# Altium project MACHXO3_STARTER KIT_22SEP14.PrjPcb
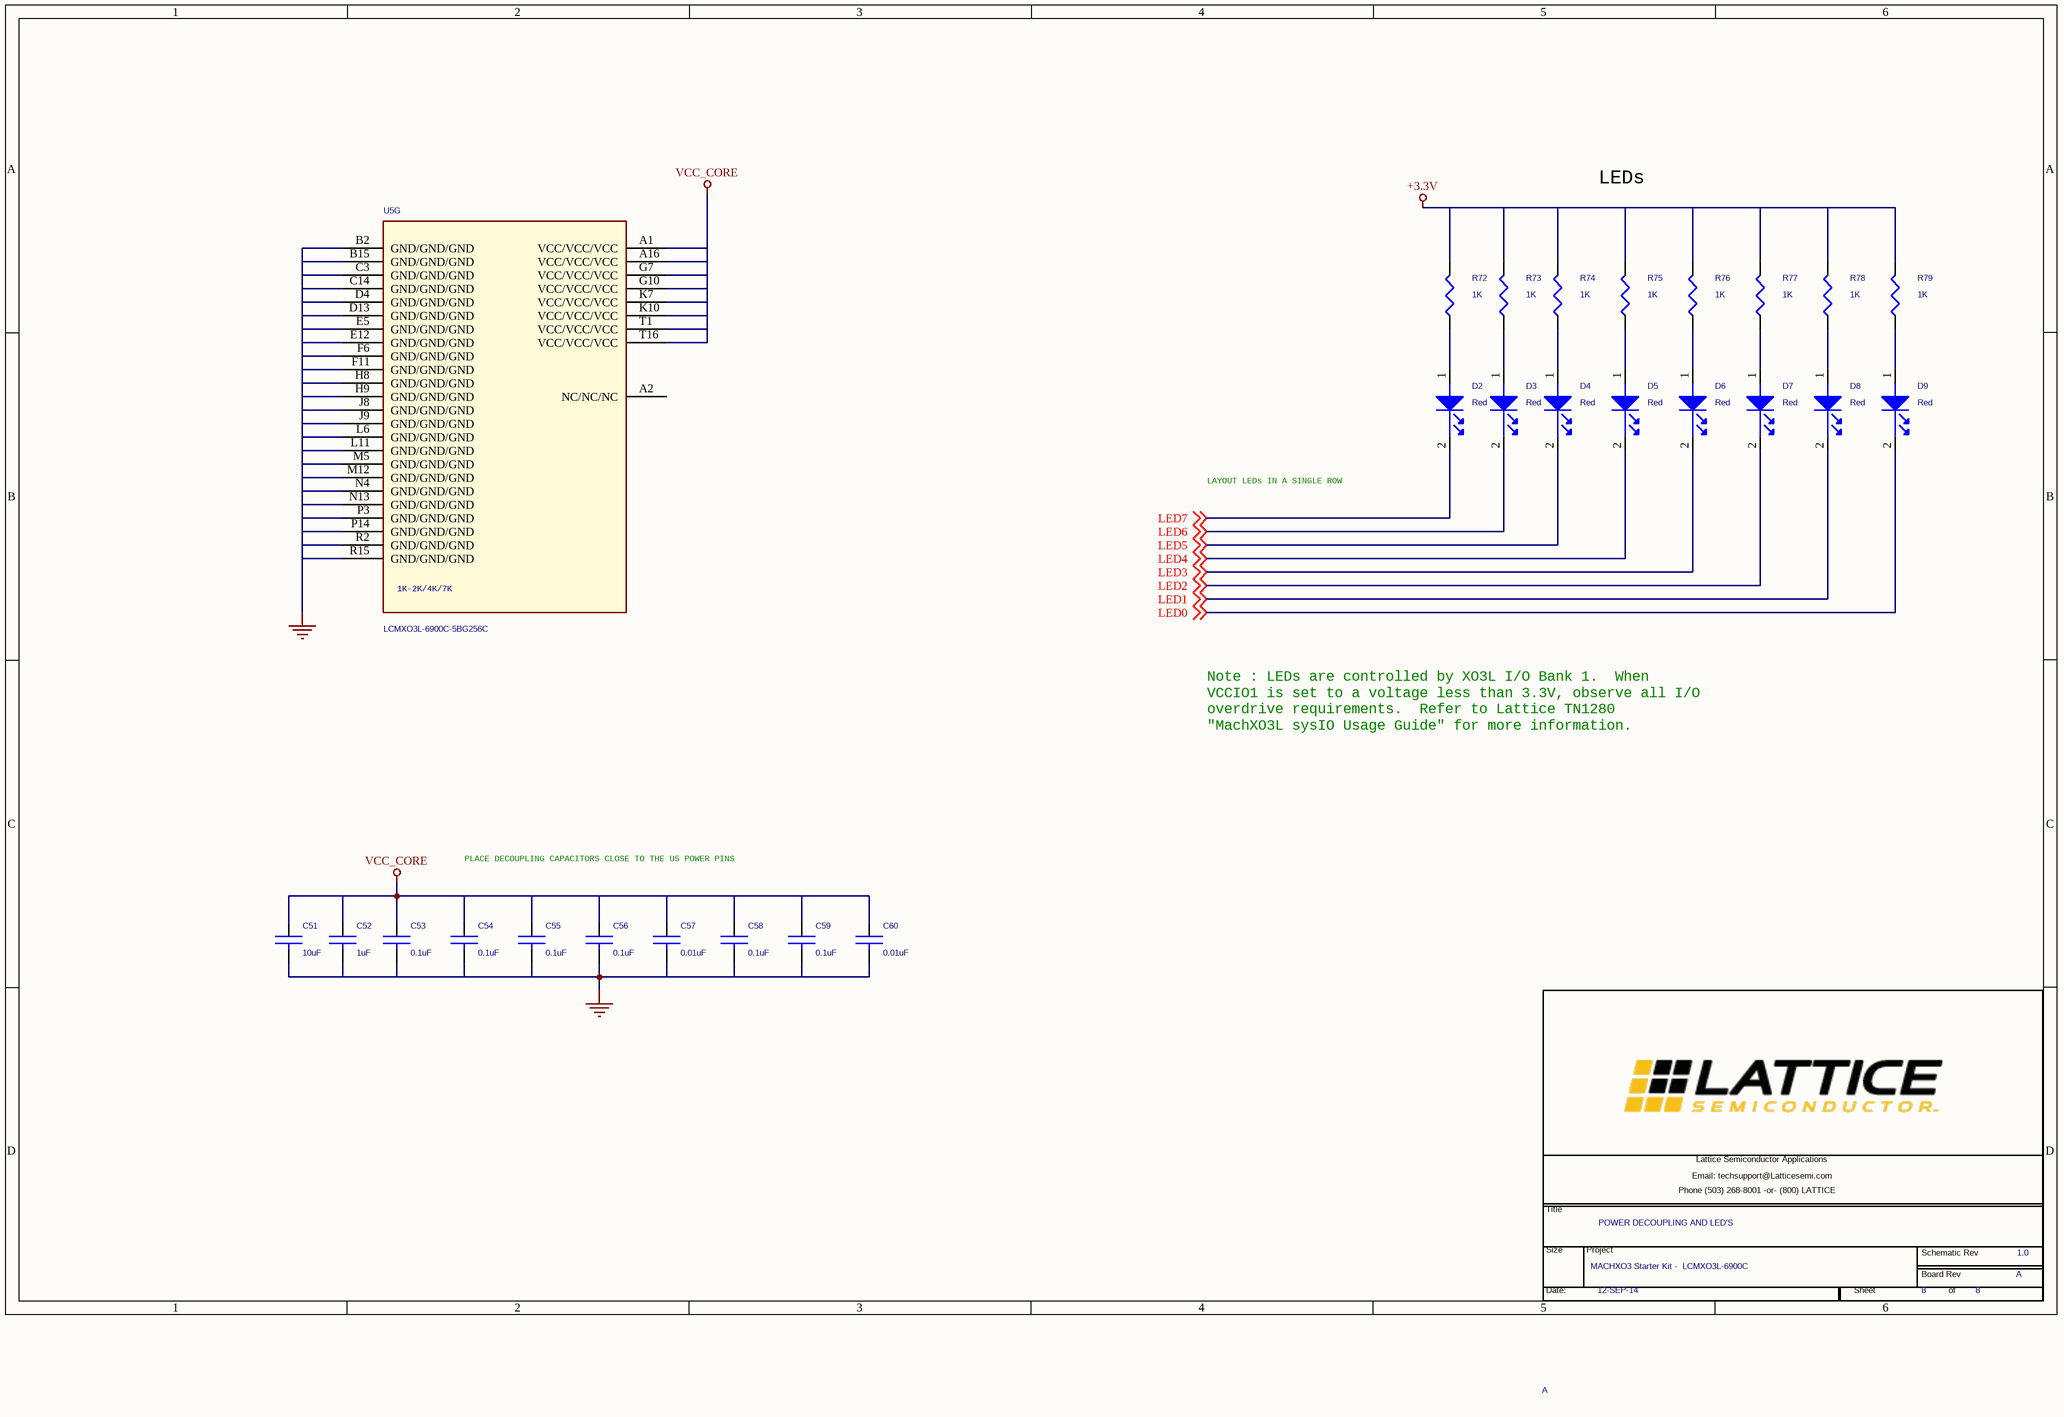
[diagram p0: PAGE8 - POWER DECAP AND.SchDoc]
8 sheets, 212 parts. Net scope: global (net labels, ports and power ports of the same name join across sheets).
Sheets:
  PAGE8 - POWER DECAP AND.SchDoc
  PAGE7 - BANK3,4,5 I_0.SchDoc
  PAGE6 - BANK2 I_0.SchDoc
  PAGE5 - BANK1 I_O.SchDoc
  PAGE4 - BANK0 I_O.SchDoc
  PAGE3 - POWER REGULATOR.SchDoc
  PAGE2 - USB to JTAG I_F.SchDoc
  PAGE1 -  Schematic cove.SchDoc

## Sheet PAGE8 - POWER DECAP AND.SchDoc
size 386 x 246 mm

### Parts
(Parts that share a designator on the sheet are numbered #1, #2 ... from top to bottom, then left to right.)
*#1  Project Name: MACHXO3 Starter Kit -  LCMXO3L-6900C  Title: POWER DECOUPLING AND LED'S  Page Number: 8  RevCode: 1.0  Page Size: A  Date:: 12-SEP-14  (hidden comment: Lattice Title Block New Brand)  (graphical)
C51  10uF  [cc0603]
C52  1uF  [cc0402]
C53  0.1uF  [cc0402]
C54  0.1uF  [cc0402]
C55  0.1uF  [cc0402]
C56  0.1uF  [cc0402]
C57  0.01uF  [cc0402]
C58  0.1uF  [cc0402]
C59  0.1uF  [cc0402]
C60  0.01uF  [cc0402]
D2  Red  [led_0603]
D3  Red  [led_0603]
D4  Red  [led_0603]
D5  Red  [led_0603]
D6  Red  [led_0603]
D7  Red  [led_0603]
D8  Red  [led_0603]
D9  Red  [led_0603]
R72  1K  [cr0402]
R73  1K  [cr0402]
R74  1K  [cr0402]
R75  1K  [cr0402]
R76  1K  [cr0402]
R77  1K  [cr0402]
R78  1K  [cr0402]
R79  1K  [cr0402]
U5  LCMXO3L-6900C-5BG256C  [bga256_0p8_14p0]  (part G of 7)

### Nets
+3.3V: R72.2 R73.2 R74.2 R75.2 R76.2 R77.2 R78.2 R79.2
GND: C51.2 C52.2 C53.2 C54.2 C55.2 C56.2 C57.2 C58.2 C59.2 C60.2 U5.B2(GND/GND/GND) U5.B15(GND/GND/GND) U5.C3(GND/GND/GND) U5.C14(GND/GND/GND) U5.D4(GND/GND/GND) U5.D13(GND/GND/GND) U5.E5(GND/GND/GND) U5.E12(GND/GND/GND) U5.F6(GND/GND/GND) U5.F11(GND/GND/GND) U5.H8(GND/GND/GND) U5.H9(GND/GND/GND) U5.J8(GND/GND/GND) U5.J9(GND/GND/GND) U5.L6(GND/GND/GND) U5.L11(GND/GND/GND) U5.M5(GND/GND/GND) U5.M12(GND/GND/GND) U5.N4(GND/GND/GND) U5.N13(GND/GND/GND) U5.P3(GND/GND/GND) U5.P14(GND/GND/GND) U5.R2(GND/GND/GND) U5.R15(GND/GND/GND)
VCC_CORE: C51.1 C52.1 C53.1 C54.1 C55.1 C56.1 C57.1 C58.1 C59.1 C60.1 U5.A1(VCC/VCC/VCC) U5.A16(VCC/VCC/VCC) U5.G7(VCC/VCC/VCC) U5.G10(VCC/VCC/VCC) U5.K7(VCC/VCC/VCC) U5.K10(VCC/VCC/VCC) U5.T1(VCC/VCC/VCC) U5.T16(VCC/VCC/VCC)
LED0: D9.2(CATHODE) ; off-sheet LED0
LED1: D8.2(CATHODE) ; off-sheet LED1
LED2: D7.2(CATHODE) ; off-sheet LED2
LED3: D6.2(CATHODE) ; off-sheet LED3
LED4: D5.2(CATHODE) ; off-sheet LED4
LED5: D4.2(CATHODE) ; off-sheet LED5
LED6: D3.2(CATHODE) ; off-sheet LED6
LED7: D2.2(CATHODE) ; off-sheet LED7
NetD2_1: D2.1(ANODE) R72.1
NetD3_1: D3.1(ANODE) R73.1
NetD4_1: D4.1(ANODE) R74.1
NetD5_1: D5.1(ANODE) R75.1
NetD6_1: D6.1(ANODE) R76.1
NetD7_1: D7.1(ANODE) R77.1
NetD8_1: D8.1(ANODE) R78.1
NetD9_1: D9.1(ANODE) R79.1

Not connected (* = marked no-connect by the designer): U5 A2(NC/NC/NC)

### Notes on the sheet
- LEDs
- LAYOUT LEDs IN A SINGLE ROW
- Note : LEDs are controlled by XO3L I/O Bank 1.  When
  VCCIO1 is set to a voltage less than 3.3V, observe all I/O
  overdrive requirements.  Refer to Lattice TN1280
  "MachXO3L sysIO Usage Guide" for more information.
- PLACE DECOUPLING CAPACITORS CLOSE TO THE U5 POWER PINS
- (in symbol Lattice Title Block New Brand) Lattice Semiconductor Applications; Email: techsupport@Latticesemi.com; Phone (503) 268-8001 -or- (800) LATTICE; Title; Size; Project; Schematic Rev; Board Rev; Date:; Sheet; of
- (in symbol LCMXO3L-1K/2K/4K/7K-BG256, part G) 1K-2K/4K/7K

### Library data of the parts
C51 = 10uF_0603: CAP CER 10UF 10V 20% X5R 0603; Manufacturer Part Number: LMK107BJ106MALTD; Manufacturer: Taiyo Yuden; Class: Discrete; Digikey P/N: 587-2562-1-ND
C52 = 1uF_0402: CAP CER 1UF 6.3V 10% X5R 0402; Manufacturer Part Number: C0402C105K9PACTU; Manufacturer: Kemet; Class: Discrete; Digikey P/N: 399-4873-1-ND
C53-C56 C58 C59 = 0u1_0402: CAP CER 0.1UF 16V 10% X7R 0402; Manufacturer Part Number: C0402C104K4RACTU; Manufacturer: Kemet; Class: Discrete; Digikey P/N: 399-3521-2-ND
C57 C60 = 0_01uF_0402: CAP CER 10000PF 16V 5% X7R 0402; Manufacturer Part Number: C0402C103J4RACTU; Manufacturer: Kemet; Class: Discrete; Digikey P/N: 399-1039-1-ND
D2-D9 = LED_0603_Red: LED SUPER RED CLEAR 0603 SMD; Manufacturer Part Number: LTST-C190KRKT; Manufacturer: LITE-On INC; Class: Discrete; Digikey P/N: 160-1436-2-ND
R72-R79 = 1k_0402: RES 1K OHM 1/10W 1% 0603 SMD; Manufacturer: Yageo; Manufacturer Part Number: RC0603FR-071KL; Class: Discrete; Digikey P/N: 311-1.00KHRCT-ND
U5 = LCMXO3L-1K/2K/4K/7K-BG256: IC FPGA 6864LUTS 256BGA; Manufacturer: Lattice semi; SPLIT_INST: TRUE; SWAP_INFO: (S1+S2+S3+S4+S5+S6+S7); Graphic: LCMXO3L-1K/2K/4K/7K-BG256A.Normal; Power Pins Visible: False; Source Library: D:\DESIGN_DOC\XO3\LATTICEORCADCAPTURESCHEMATICLIBRARYOLB\LATTICEORCADCAPTURESCHEMATICLIBRARYOLB\LATTICE_SYM\LATTICEPLDS.OLB; Location Y-Coordinate: 0; Implementation Type: <none>; Primitive: DEFAULT; Name: I16790692; Digikey P/N: 220-1886-ND; Manufacturer Part Number: LCMXO3L-6900C-5BG256C; Source Package: LCMXO3L-1K/2K/4K/7K-BG256; Source Part: LCMXO3L-1K/2K/4K/7K-BG256A.Normal; Color: Default; Location X-Coordinate: 0
*#1 = Lattice Title Block New Brand: Page Count: 8; Board Rev: A

## Sheet PAGE7 - BANK3,4,5 I_0.SchDoc
size 386 x 246 mm
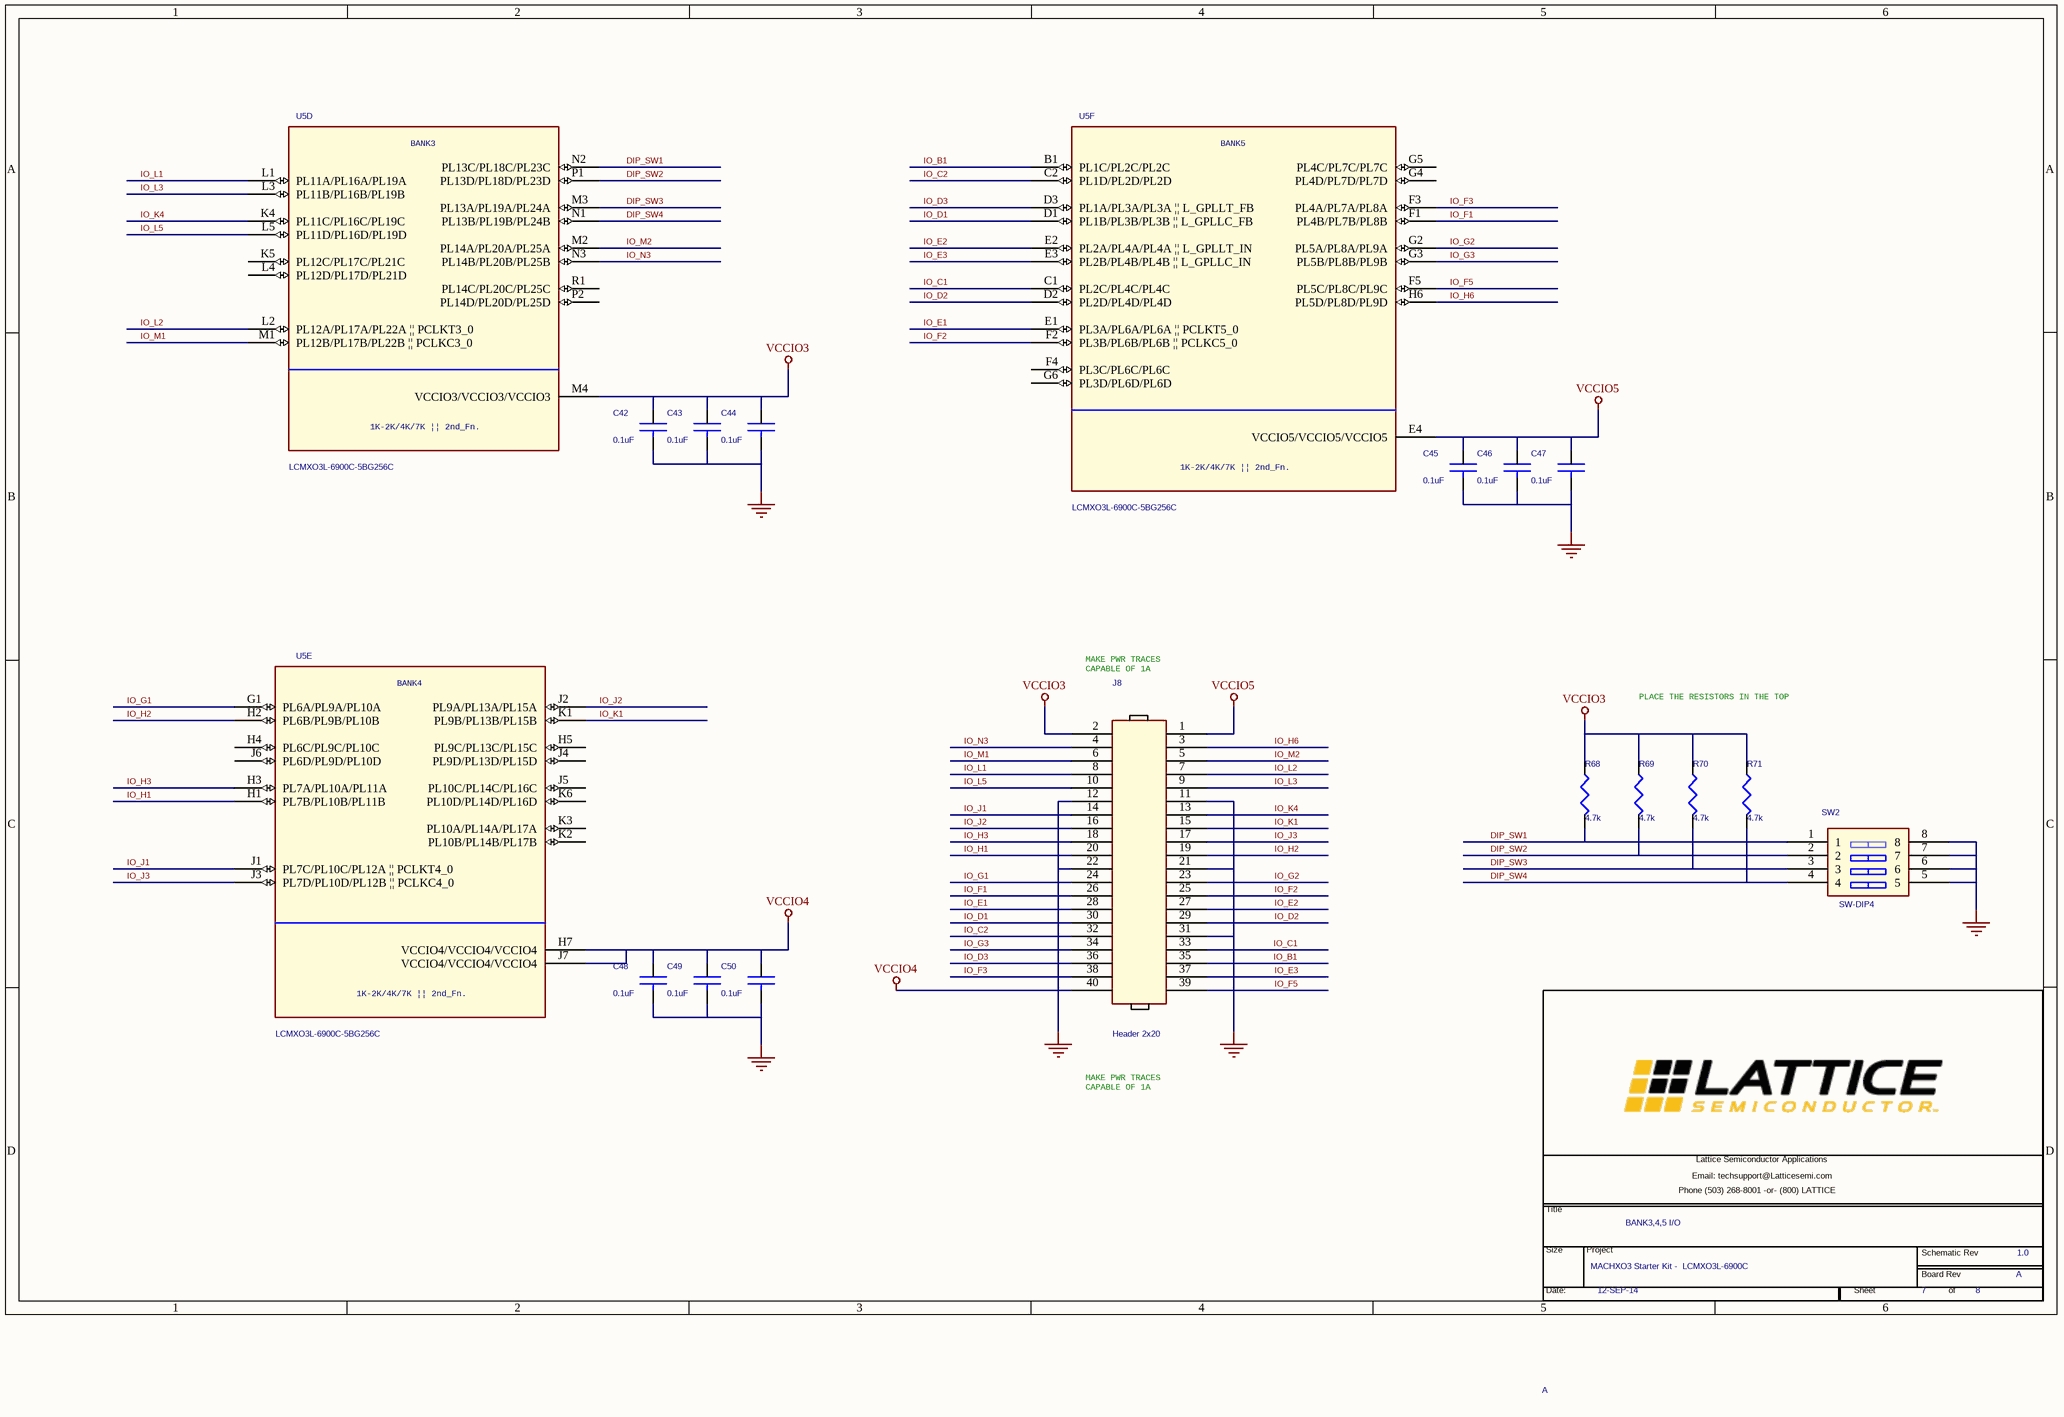
[diagram p1: PAGE7 - BANK3,4,5 I_0.SchDoc]

### Parts
(Parts that share a designator on the sheet are numbered #1, #2 ... from top to bottom, then left to right.)
*#2  Project Name: MACHXO3 Starter Kit -  LCMXO3L-6900C  Title: BANK3,4,5 I/O  Page Number: 7  Page Count: 8  RevCode: 1.0  Page Size: A  Date:: 12-SEP-14  (hidden comment: Lattice Title Block New Brand)  (graphical)
C42  0.1uF  [cc0402]
C43  0.1uF  [cc0402]
C44  0.1uF  [cc0402]
C45  0.1uF  [cc0402]
C46  0.1uF  [cc0402]
C47  0.1uF  [cc0402]
C48  0.1uF  [cc0402]
C49  0.1uF  [cc0402]
C50  0.1uF  [cc0402]
J8  Header 2x20  [hdr_samtec_mtsw_2x20_100]
R68  4.7k  [cr0402]
R69  4.7k  [cr0402]
R70  4.7k  [cr0402]
R71  4.7k  [cr0402]
SW2  SW-DIP4  [sw_sp_st_cts_195-4mst]
U5  LCMXO3L-6900C-5BG256C  [bga256_0p8_14p0]  (parts D,E,F of 7)

### Nets
GND: C42.2 C43.2 C44.2 C45.2 C46.2 C47.2 C48.2 C49.2 C50.2 J8.11 J8.12 J8.21 J8.22 J8.31 SW2.5 SW2.6 SW2.7 SW2.8
VCCIO3: C42.1 C43.1 C44.1 J8.2 R68.1 R69.1 R70.1 R71.1 U5.M4(VCCIO3/VCCIO3/VCCIO3)
VCCIO4: C48.1 C49.1 C50.1 J8.40 U5.H7(VCCIO4/VCCIO4/VCCIO4) U5.J7(VCCIO4/VCCIO4/VCCIO4)
VCCIO5: C45.1 C46.1 C47.1 J8.1 U5.E4(VCCIO5/VCCIO5/VCCIO5)
DIP_SW1: R68.2 SW2.1 U5.N2(PL13C/PL18C/PL23C)
DIP_SW2: R69.2 SW2.2 U5.P1(PL13D/PL18D/PL23D)
DIP_SW3: R70.2 SW2.3 U5.M3(PL13A/PL19A/PL24A)
DIP_SW4: R71.2 SW2.4 U5.N1(PL13B/PL19B/PL24B)
IO_B1: J8.35 U5.B1(PL1C/PL2C/PL2C)
IO_C1: J8.33 U5.C1(PL2C/PL4C/PL4C)
IO_C2: J8.32 U5.C2(PL1D/PL2D/PL2D)
IO_D1: J8.30 U5.D1(PL1B/PL3B/PL3B_||_L_GPLLC_FB)
IO_D2: J8.29 U5.D2(PL2D/PL4D/PL4D)
IO_D3: J8.36 U5.D3(PL1A/PL3A/PL3A_||_L_GPLLT_FB)
IO_E1: J8.28 U5.E1(PL3A/PL6A/PL6A_||_PCLKT5_0)
IO_E2: J8.27 U5.E2(PL2A/PL4A/PL4A_||_L_GPLLT_IN)
IO_E3: J8.37 U5.E3(PL2B/PL4B/PL4B_||_L_GPLLC_IN)
IO_F1: J8.26 U5.F1(PL4B/PL7B/PL8B)
IO_F2: J8.25 U5.F2(PL3B/PL6B/PL6B_||_PCLKC5_0)
IO_F3: J8.38 U5.F3(PL4A/PL7A/PL8A)
IO_F5: J8.39 U5.F5(PL5C/PL8C/PL9C)
IO_G1: J8.24 U5.G1(PL6A/PL9A/PL10A)
IO_G2: J8.23 U5.G2(PL5A/PL8A/PL9A)
IO_G3: J8.34 U5.G3(PL5B/PL8B/PL9B)
IO_H1: J8.20 U5.H1(PL7B/PL10B/PL11B)
IO_H2: J8.19 U5.H2(PL6B/PL9B/PL10B)
IO_H3: J8.18 U5.H3(PL7A/PL10A/PL11A)
IO_H6: J8.3 U5.H6(PL5D/PL8D/PL9D)
IO_J1: J8.14 U5.J1(PL7C/PL10C/PL12A_||_PCLKT4_0)
IO_J2: J8.16 U5.J2(PL9A/PL13A/PL15A)
IO_J3: J8.17 U5.J3(PL7D/PL10D/PL12B_||_PCLKC4_0)
IO_K1: J8.15 U5.K1(PL9B/PL13B/PL15B)
IO_K4: J8.13 U5.K4(PL11C/PL16C/PL19C)
IO_L1: J8.8 U5.L1(PL11A/PL16A/PL19A)
IO_L2: J8.7 U5.L2(PL12A/PL17A/PL22A_||_PCLKT3_0)
IO_L3: J8.9 U5.L3(PL11B/PL16B/PL19B)
IO_L5: J8.10 U5.L5(PL11D/PL16D/PL19D)
IO_M1: J8.6 U5.M1(PL12B/PL17B/PL22B_||_PCLKC3_0)
IO_M2: J8.5 U5.M2(PL14A/PL20A/PL25A)
IO_N3: J8.4 U5.N3(PL14B/PL20B/PL25B)

Not connected (* = marked no-connect by the designer): U5 F4(PL3C/PL6C/PL6C) G4(PL4D/PL7D/PL7D) G5(PL4C/PL7C/PL7C) G6(PL3D/PL6D/PL6D) H4(PL6C/PL9C/PL10C) H5(PL9C/PL13C/PL15C) J4(PL9D/PL13D/PL15D) J5(PL10C/PL14C/PL16C) J6(PL6D/PL9D/PL10D) K2(PL10B/PL14B/PL17B) K3(PL10A/PL14A/PL17A) K5(PL12C/PL17C/PL21C) K6(PL10D/PL14D/PL16D) L4(PL12D/PL17D/PL21D) P2(PL14D/PL20D/PL25D) R1(PL14C/PL20C/PL25C)

### Notes on the sheet
- MAKE PWR TRACES
  CAPABLE OF 1A
- PLACE THE RESISTORS IN THE TOP
- (in symbol Lattice Title Block New Brand) Lattice Semiconductor Applications; Email: techsupport@Latticesemi.com; Phone (503) 268-8001 -or- (800) LATTICE; Title; Size; Project; Schematic Rev; Board Rev; Date:; Sheet; of
- (in symbol LCMXO3L-1K/2K/4K/7K-BG256, part D) BANK3; 1K-2K/4K/7K || 2nd_Fn.
- (in symbol LCMXO3L-1K/2K/4K/7K-BG256, part E) BANK4; 1K-2K/4K/7K || 2nd_Fn.
- (in symbol LCMXO3L-1K/2K/4K/7K-BG256, part F) BANK5; 1K-2K/4K/7K || 2nd_Fn.

### Library data of the parts
C42-C50 = 0u1_0402: as C53 on sheet PAGE8 - POWER DECAP AND; Digikey P/N: 399-3521-2-ND
J8 = HEADER 20X2: CONN HEADER 40POS .100" DL GOLD; Manufacturer: Samtec; Manufacturer Part Number: TSW-120-07-G-D; ASSY: DNI; Digikey P/N: SAM1028-20-ND
R68-R71 = 5k1_0402: RES 4.70K OHM 1/10W 1% 0603 SMD; Manufacturer: Vishay; Manufacturer Part Number: CRCW06034K70FKEA; Class: Discrete; Digikey P/N: 541-4.70KHTR-ND
SW2 = DIP-SW: SWITCH SIDE ACTUATED 4 SEC 50V; Manufacturer Part Number: 195-4MST; Manufacturer: CTS Electrocomponents; Digikey P/N: CT1954MST-ND
U5 = LCMXO3L-1K/2K/4K/7K-BG256: IC FPGA 6864LUTS 256BGA; Manufacturer: Lattice semi; Source Part: LCMXO3L-1K/2K/4K/7K-BG256A.Normal; SPLIT_INST: TRUE; SWAP_INFO: (S1+S2+S3+S4+S5+S6+S7); Name: I16790692; Primitive: DEFAULT; Implementation Type: <none>; Location X-Coordinate: 0; Source Library: D:\DESIGN_DOC\XO3\LATTICEORCADCAPTURESCHEMATICLIBRARYOLB\LATTICEORCADCAPTURESCHEMATICLIBRARYOLB\LATTICE_SYM\LATTICEPLDS.OLB; Power Pins Visible: False; Digikey P/N: 220-1886-ND; Location Y-Coordinate: 0; Color: Default; Source Package: LCMXO3L-1K/2K/4K/7K-BG256; Graphic: LCMXO3L-1K/2K/4K/7K-BG256A.Normal; Manufacturer Part Number: LCMXO3L-6900C-5BG256C
*#2 = Lattice Title Block New Brand: Board Rev: A

## Sheet PAGE6 - BANK2 I_0.SchDoc
size 386 x 246 mm
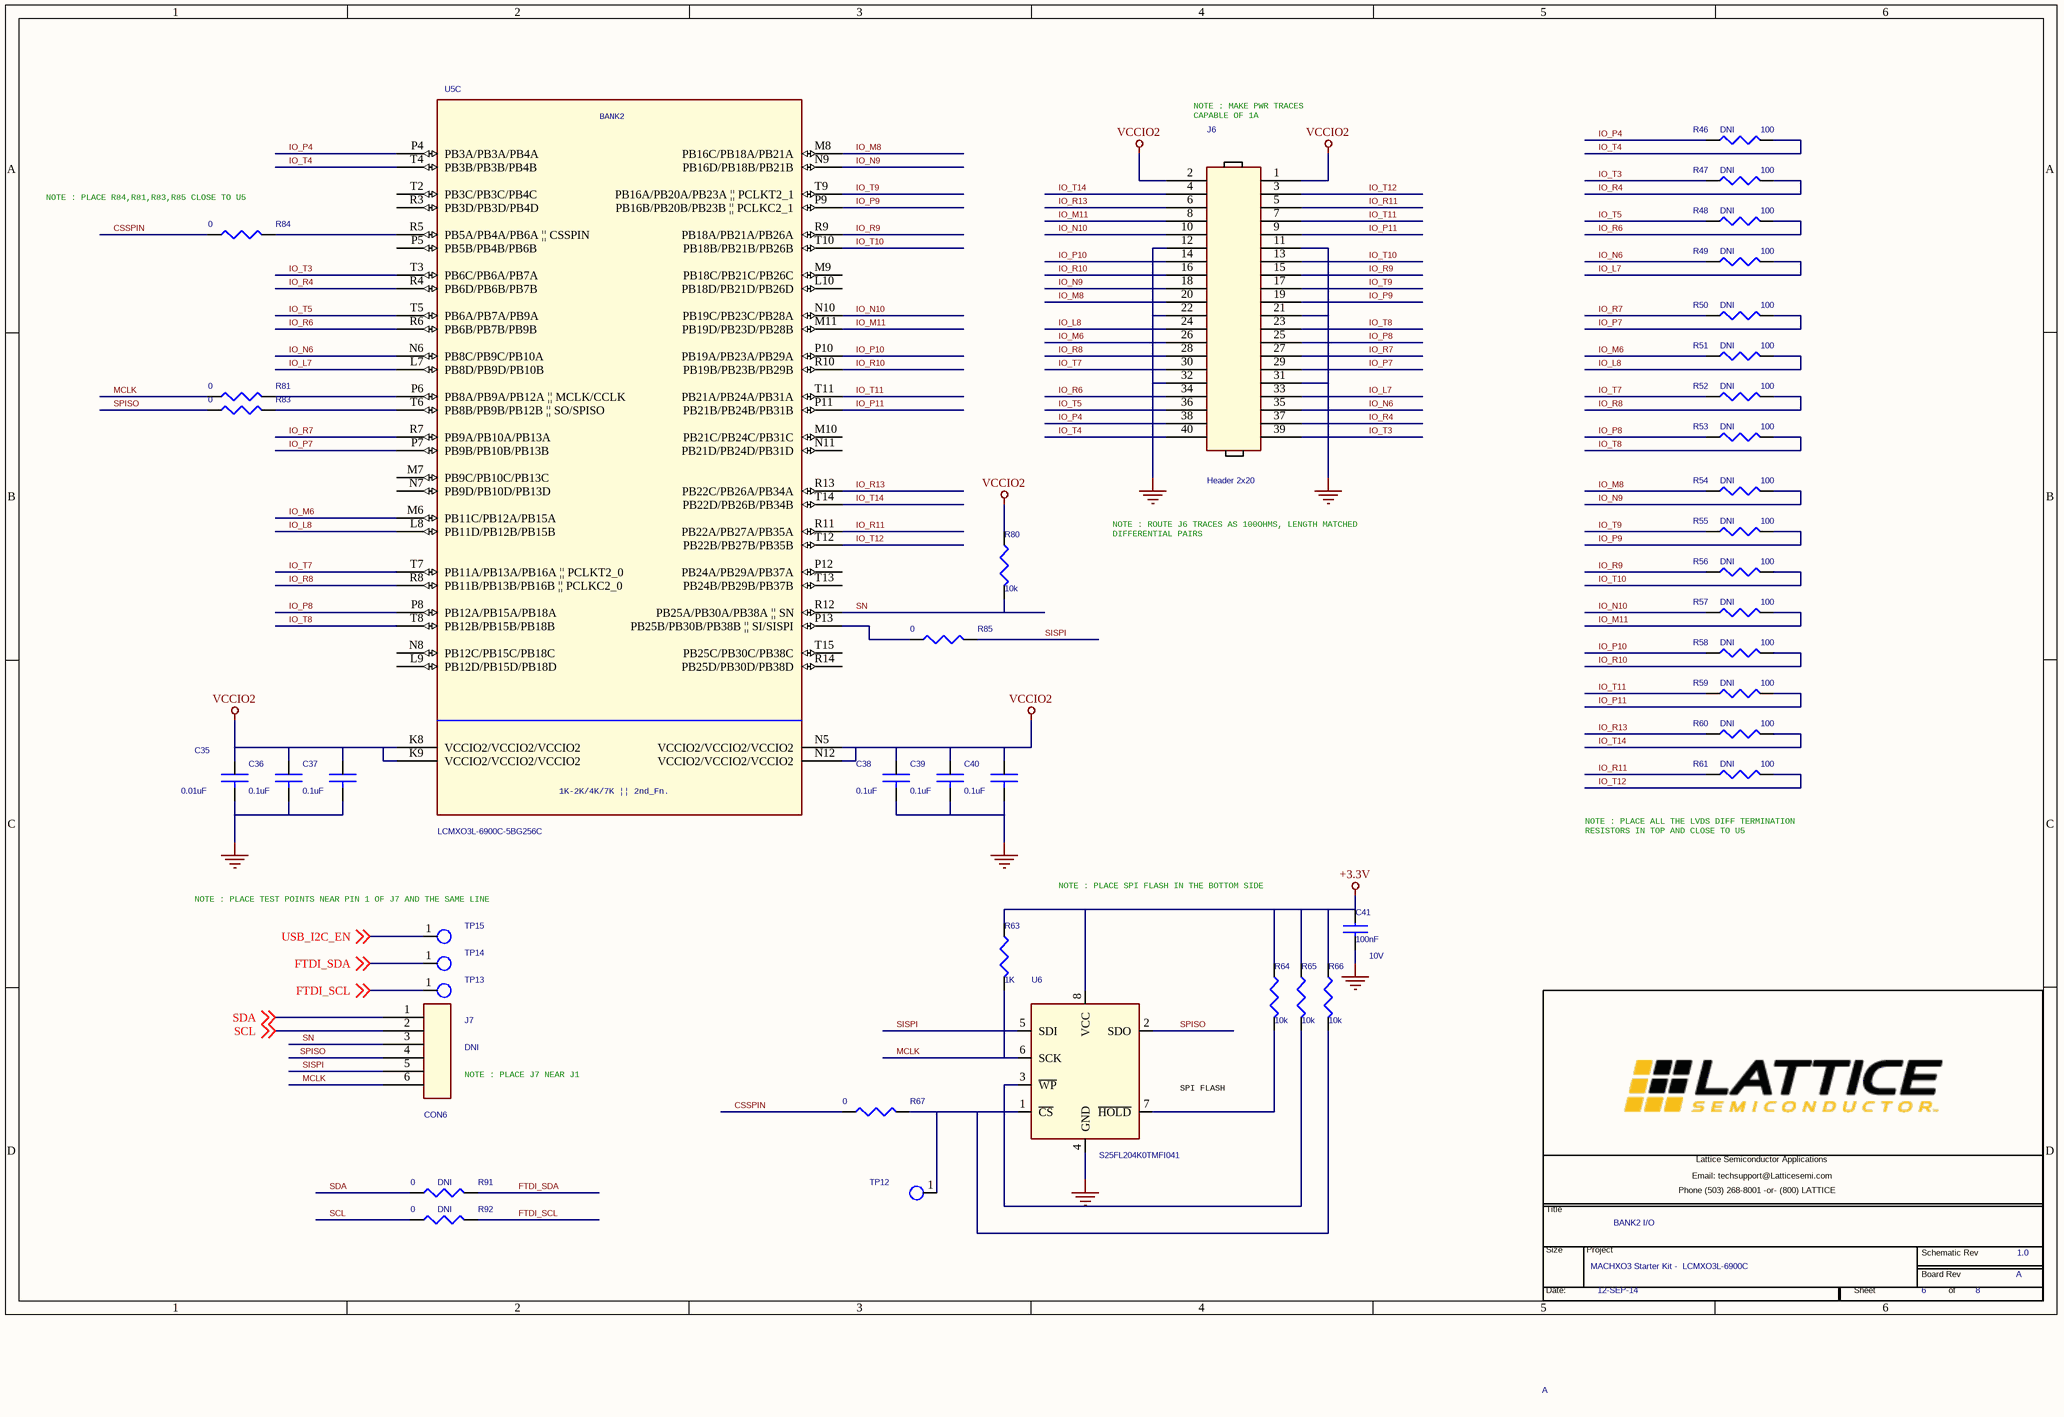
[diagram p2: PAGE6 - BANK2 I_0.SchDoc]

### Parts
(Parts that share a designator on the sheet are numbered #1, #2 ... from top to bottom, then left to right.)
*#3  Project Name: MACHXO3 Starter Kit -  LCMXO3L-6900C  Title: BANK2 I/O  Page Number: 6  Page Count: 8  RevCode: 1.0  Page Size: A  Date:: 12-SEP-14  (hidden comment: Lattice Title Block New Brand)  (graphical)
C35  0.01uF  [cc0402]
C36  0.1uF  [cc0402]
C37  0.1uF  [cc0402]
C38  0.1uF  [cc0402]
C39  0.1uF  [cc0402]
C40  0.1uF  [cc0402]
C41  100nF  Voltage: 10V  [C0402]
J6  Header 2x20  [hdr_samtec_mtsw_2x20_100]
J7  CON6  Assy: DNI  [hdr_samtec_tsw_1x6_100]
R46  100  Assy: DNI  [cr0603]
R47  100  Assy: DNI  [cr0603]
R48  100  Assy: DNI  [cr0603]
R49  100  Assy: DNI  [cr0603]
R50  100  Assy: DNI  [cr0603]
R51  100  Assy: DNI  [cr0603]
R52  100  Assy: DNI  [cr0603]
R53  100  Assy: DNI  [cr0603]
R54  100  Assy: DNI  [cr0603]
R55  100  Assy: DNI  [cr0603]
R56  100  Assy: DNI  [cr0603]
R57  100  Assy: DNI  [cr0603]
R58  100  Assy: DNI  [cr0603]
R59  100  Assy: DNI  [cr0603]
R60  100  Assy: DNI  [cr0603]
R61  100  Assy: DNI  [cr0603]
R63  1K  [R0402]
R64  10k  [R0402]
R65  10k  [R0402]
R66  10k  [R0402]
R67  0  [cr0603]
R80  10k  [R0402]
R81  0  [cr0603]
R83  0  [cr0603]
R84  0  [cr0603]
R85  0  [cr0603]
R91  0  Assy: DNI  [cr0603]
R92  0  Assy: DNI  [cr0603]
TP12  tp_s_40_63  [tp_s_40_63]  (value not drawn)
TP13  tp_s_40_63  [tp_s_40_63]  (value not drawn)
TP14  tp_s_40_63  [tp_s_40_63]  (value not drawn)
TP15  tp_s_40_63  [tp_s_40_63]  (value not drawn)
U5  LCMXO3L-6900C-5BG256C  [bga256_0p8_14p0]  (part C of 7)
U6  S25FL204K0TMFI041  [so8_50_244]

### Nets
+3.3V: C41.1 R63.1 R64.1 R65.1 R66.1 U6.8(VCC)
GND: C35.2 C36.2 C37.2 C38.2 C39.2 C40.2 C41.2 J6.11 J6.12 J6.21 J6.22 J6.31 J6.32 U6.4(GND)
VCCIO2: C35.1 C36.1 C37.1 C38.1 C39.1 C40.1 J6.1 J6.2 R80.1 U5.K8(VCCIO2/VCCIO2/VCCIO2) U5.K9(VCCIO2/VCCIO2/VCCIO2) U5.N5(VCCIO2/VCCIO2/VCCIO2) U5.N12(VCCIO2/VCCIO2/VCCIO2)
CSSPIN: R67.1 R84.1
FTDI_SCL: R92.2 TP13.1(TP) ; off-sheet FTDI_SCL
FTDI_SDA: R91.2 TP14.1(TP) ; off-sheet FTDI_SDA
IO_L7: J6.33 R49.2 U5.L7(PB8D/PB9D/PB10B)
IO_L8: J6.24 R51.2 U5.L8(PB11D/PB12B/PB15B)
IO_M6: J6.26 R51.1 U5.M6(PB11C/PB12A/PB15A)
IO_M8: J6.20 R54.1 U5.M8(PB16C/PB18A/PB21A)
IO_M11: J6.8 R57.2 U5.M11(PB19D/PB23D/PB28B)
IO_N6: J6.35 R49.1 U5.N6(PB8C/PB9C/PB10A)
IO_N9: J6.18 R54.2 U5.N9(PB16D/PB18B/PB21B)
IO_N10: J6.10 R57.1 U5.N10(PB19C/PB23C/PB28A)
IO_P4: J6.38 R46.1 U5.P4(PB3A/PB3A/PB4A)
IO_P7: J6.29 R50.2 U5.P7(PB9B/PB10B/PB13B)
IO_P8: J6.25 R53.1 U5.P8(PB12A/PB15A/PB18A)
IO_P9: J6.19 R55.2 U5.P9(PB16B/PB20B/PB23B_||_PCLKC2_1)
IO_P10: J6.14 R58.1 U5.P10(PB19A/PB23A/PB29A)
IO_P11: J6.9 R59.2 U5.P11(PB21B/PB24B/PB31B)
IO_R4: J6.37 R47.2 U5.R4(PB6D/PB6B/PB7B)
IO_R6: J6.34 R48.2 U5.R6(PB6B/PB7B/PB9B)
IO_R7: J6.27 R50.1 U5.R7(PB9A/PB10A/PB13A)
IO_R8: J6.28 R52.2 U5.R8(PB11B/PB13B/PB16B_||_PCLKC2_0)
IO_R9: J6.15 R56.1 U5.R9(PB18A/PB21A/PB26A)
IO_R10: J6.16 R58.2 U5.R10(PB19B/PB23B/PB29B)
IO_R11: J6.5 R61.1 U5.R11(PB22A/PB27A/PB35A)
IO_R13: J6.6 R60.1 U5.R13(PB22C/PB26A/PB34A)
IO_T3: J6.39 R47.1 U5.T3(PB6C/PB6A/PB7A)
IO_T4: J6.40 R46.2 U5.T4(PB3B/PB3B/PB4B)
IO_T5: J6.36 R48.1 U5.T5(PB6A/PB7A/PB9A)
IO_T7: J6.30 R52.1 U5.T7(PB11A/PB13A/PB16A_||_PCLKT2_0)
IO_T8: J6.23 R53.2 U5.T8(PB12B/PB15B/PB18B)
IO_T9: J6.17 R55.1 U5.T9(PB16A/PB20A/PB23A_||_PCLKT2_1)
IO_T10: J6.13 R56.2 U5.T10(PB18B/PB21B/PB26B)
IO_T11: J6.7 R59.1 U5.T11(PB21A/PB24A/PB31A)
IO_T12: J6.3 R61.2 U5.T12(PB22B/PB27B/PB35B)
IO_T14: J6.4 R60.2 U5.T14(PB22D/PB26B/PB34B)
MCLK: J7.6 R63.2 R81.1 U6.6(SCK)
SCL: J7.2 R92.1 ; off-sheet SCL
SDA: J7.1 R91.1 ; off-sheet SDA
SISPI: J7.5 R85.2 U6.5(SDI)
SN: J7.3 R80.2 U5.R12(PB25A/PB30A/PB38A_||_SN)
SPISO: J7.4 R83.1 U6.2(SDO)
USB_I2C_EN: TP15.1(TP) ; off-sheet USB_I2C_EN
NetR64_2: R64.2 U6.7(~{HOLD})
NetR65_2: R65.2 U6.3(~{WP})
NetR66_2: R66.2 R67.2 TP12.1(TP) U6.1(~{CS})
NetR81_2: R81.2 U5.P6(PB8A/PB9A/PB12A_||_MCLK/CCLK)
NetR83_2: R83.2 U5.T6(PB8B/PB9B/PB12B_||_SO/SPISO)
NetR84_2: R84.2 U5.R5(PB5A/PB4A/PB6A_||_CSSPIN)
NetR85_1: R85.1 U5.P13(PB25B/PB30B/PB38B_||_SI/SISPI)

Not connected (* = marked no-connect by the designer): U5 L9(PB12D/PB15D/PB18D) L10(PB18D/PB21D/PB26D) M7(PB9C/PB10C/PB13C) M9(PB18C/PB21C/PB26C) M10(PB21C/PB24C/PB31C) N7(PB9D/PB10D/PB13D) N8(PB12C/PB15C/PB18C) N11(PB21D/PB24D/PB31D) P5(PB5B/PB4B/PB6B) P12(PB24A/PB29A/PB37A) R3(PB3D/PB3D/PB4D) R14(PB25D/PB30D/PB38D) T2(PB3C/PB3C/PB4C) T13(PB24B/PB29B/PB37B) T15(PB25C/PB30C/PB38C)

### Notes on the sheet
- NOTE : MAKE PWR TRACES
  CAPABLE OF 1A
- (near R84) NOTE : PLACE R84,R81,R83,R85 CLOSE TO U5
- NOTE : ROUTE J6 TRACES AS 100OHMS, LENGTH MATCHED
  DIFFERENTIAL PAIRS
- (near R61) NOTE : PLACE ALL THE LVDS DIFF TERMINATION
  RESISTORS IN TOP AND CLOSE TO U5
- (near TP15) NOTE : PLACE TEST POINTS NEAR PIN 1 OF J7 AND THE SAME LINE
- NOTE : PLACE SPI FLASH IN THE BOTTOM SIDE
- (near J7) NOTE : PLACE J7 NEAR J1
- (near U6) SPI FLASH
- (in symbol Lattice Title Block New Brand) Lattice Semiconductor Applications; Email: techsupport@Latticesemi.com; Phone (503) 268-8001 -or- (800) LATTICE; Title; Size; Project; Schematic Rev; Board Rev; Date:; Sheet; of
- (in symbol LCMXO3L-1K/2K/4K/7K-BG256, part C) BANK2; 1K-2K/4K/7K || 2nd_Fn.

### Library data of the parts
C35 = 0_01uF_0402: as C57 on sheet PAGE8 - POWER DECAP AND; Digikey P/N: 399-1039-1-ND
C36-C40 = 0u1_0402: as C53 on sheet PAGE8 - POWER DECAP AND; Digikey P/N: 399-3521-2-ND
C41 = CAP_CER_100nF_0402_10V: CAP CER 0.1UF 10V 10% X5R 0402; Unit Price (USD): 0.1; MFG: Murata; MFG P/N: GRM155R61A104KA01D; Total Area(sq-mm): 0.5; Length(mm): 1; Digikey P/N: 490-1318-2-ND; Manufacturer Part Number: GRM155R61A104KA01D; Manufacturer: Murata
J6 = HEADER 20X2: CONN HEADER 40POS .100" DL GOLD; Manufacturer Part Number: TSW-120-07-G-D; Manufacturer: Samtec; ASSY: DNI; Digikey P/N: SAM1028-20-ND
J7 = CON6: CONN HEADER 6POS .100" SNGL; Manufacturer Part Number: TSW-106-07-F-S-ND; Manufacturer: Samtec; Digikey P/N: TSW-106-07-F-S-ND
R46-R61 = 100R_0603: RES 100 OHM 1/16W 1% 0402 SMD; Manufacturer: Yageo; Manufacturer Part Number: RC0402FR07100RL; Class: Discrete; Digikey P/N: 311-100LRCT-ND
R63 = RES_10K_1W16_0402_5P: RES 1K OHM 1/10W 1% 0603 SMD; Manufacturer: Yageo; TC2: 0; MFG: Stackpole Electronics Inc; MFG P/N: RC0603FR-071KL; MAX_TEMP: RTMAX; DIST: FLAT; Wattage: 1/16W; Total Area(sq-mm): 0.5; Unit Price (USD): 0.02; TC1: 0; Width(mm): 0.5; Length(mm): 1; Digikey P/N: 311-1.00KHRCT-ND; Manufacturer Part Number: RC0603FR-071KL
R64-R66 R80 = RES_10K_1W16_0402_5P: RES 10K OHM 1/10W 5% 0603; Manufacturer Part Number: RMCF0603JT10K0; TC2: 0; MFG: Stackpole Electronics Inc; MFG P/N: RMCF0402JT10K0; MAX_TEMP: RTMAX; DIST: FLAT; Total Area(sq-mm): 0.5; Unit Price (USD): 0.02; TC1: 0; Wattage: 1/10W; Width(mm): 0.5; Length(mm): 1; Manufacturer: Stackpole Electronics Inc; Digikey P/N: RMCF0603JT10K0TR-ND
R67 R81 R83-R85 R91 R92 = 0R_0603: RES 0.0 OHM 1/10W JUMP 0603 SMD; Manufacturer Part Number: RC0603JR-070RL; Manufacturer: Yageo; Class: Discrete; Digikey P/N: 311-0.0GRTR-ND
TP12-TP15 = TP_S_40_63: Square test point, 40mil inner diameter, 63mil outer diameter; Assy: DNI; Class: IO
U5 = LCMXO3L-1K/2K/4K/7K-BG256: as U5 on sheet PAGE7 - BANK3,4,5 I_0; Location Y-Coordinate: 0; Color: Default; Source Package: LCMXO3L-1K/2K/4K/7K-BG256; Graphic: LCMXO3L-1K/2K/4K/7K-BG256A.Normal; Manufacturer Part Number: LCMXO3L-6900C-5BG256C; Digikey P/N: 220-1886-ND
U6 = SPI_FLASH_32Mb_SOIC8: IC FLASH 4MBIT 85MHZ 8SO; Manufacturer: Spansion; Unit Price (USD): 1.1275; Total Area(sq-mm): 20; MFG: Micron; Cost Ea/1k: 0.74321; MFG P/N: N25Q032A13ESC40F; Length(mm): 5; Width(mm): 4; Digikey P/N: 1274-1088-ND; Manufacturer Part Number: S25FL204K0TMFI041
*#3 = Lattice Title Block New Brand: Board Rev: A

## Sheet PAGE5 - BANK1 I_O.SchDoc
size 386 x 246 mm
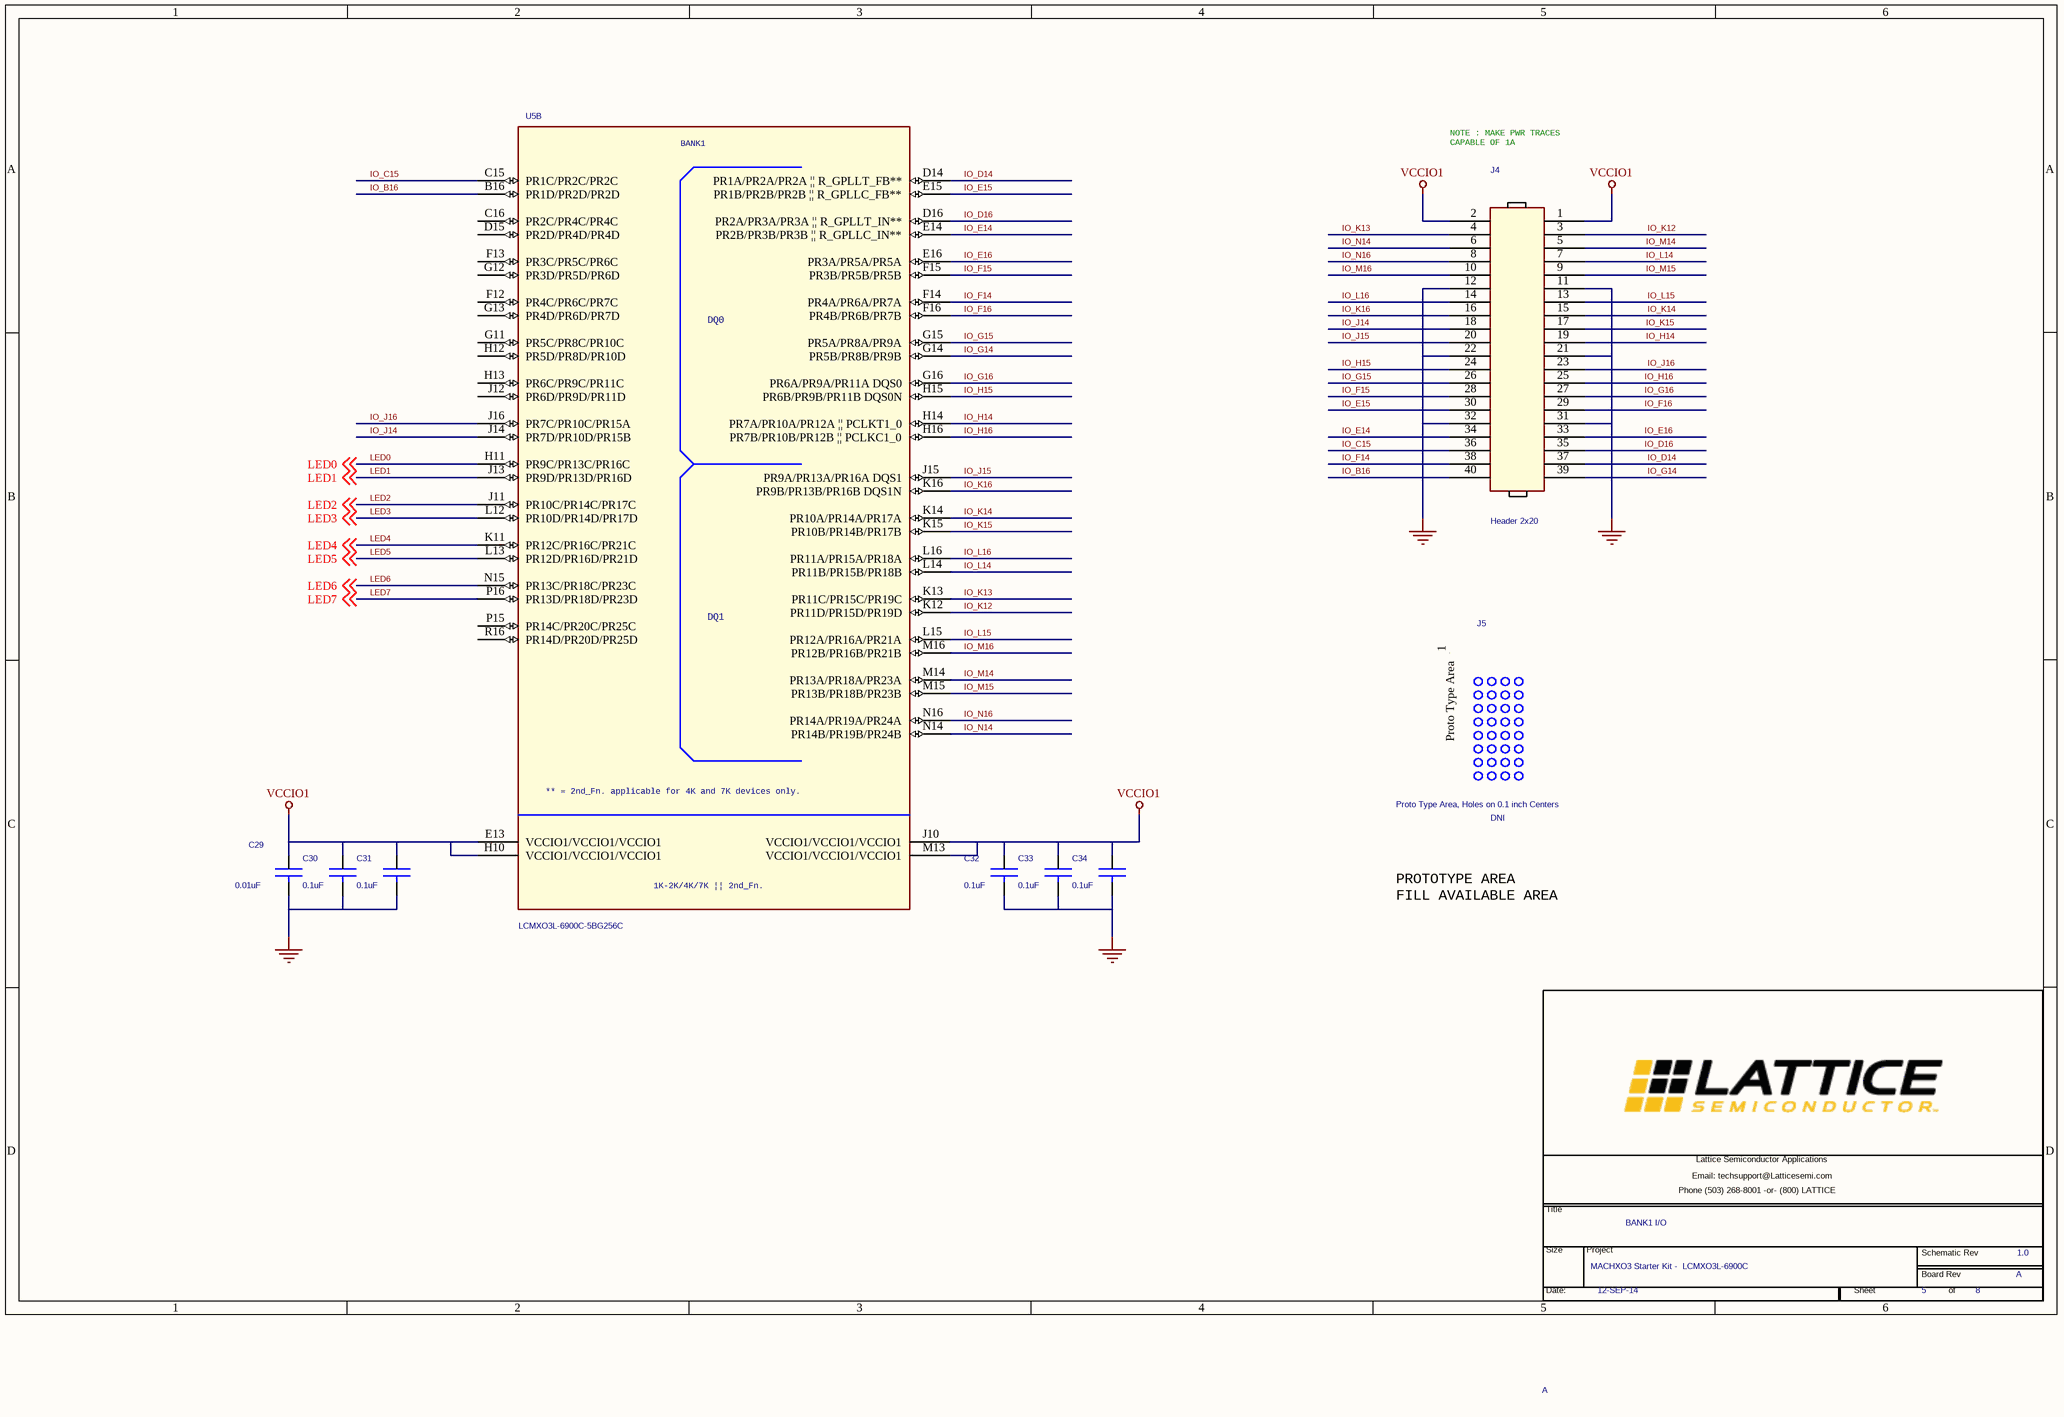
[diagram p3: PAGE5 - BANK1 I_O.SchDoc]

### Parts
(Parts that share a designator on the sheet are numbered #1, #2 ... from top to bottom, then left to right.)
*#4  Project Name: MACHXO3 Starter Kit -  LCMXO3L-6900C  Title: BANK1 I/O  Page Number: 5  Page Count: 8  RevCode: 1.0  Page Size: A  Date:: 12-SEP-14  (hidden comment: Lattice Title Block New Brand)  (graphical)
C29  0.01uF  [cc0402]
C30  0.1uF  [cc0402]
C31  0.1uF  [cc0402]
C32  0.1uF  [cc0402]
C33  0.1uF  [cc0402]
C34  0.1uF  [cc0402]
J4  Header 2x20  [hdr_samtec_mtsw_2x20_100]
J5  Proto Type Area, Holes on 0.1 inch Centers  ASSY: DNI  [hdr_th_4x10_100]
U5  LCMXO3L-6900C-5BG256C  [bga256_0p8_14p0]  (part B of 7)

### Nets
GND: C29.2 C30.2 C31.2 C32.2 C33.2 C34.2 J4.11 J4.12 J4.21 J4.22 J4.31 J4.32
VCCIO1: C29.1 C30.1 C31.1 C32.1 C33.1 C34.1 J4.1 J4.2 U5.E13(VCCIO1/VCCIO1/VCCIO1) U5.H10(VCCIO1/VCCIO1/VCCIO1) U5.J10(VCCIO1/VCCIO1/VCCIO1) U5.M13(VCCIO1/VCCIO1/VCCIO1)
IO_B16: J4.40 U5.B16(PR1D/PR2D/PR2D)
IO_C15: J4.36 U5.C15(PR1C/PR2C/PR2C)
IO_D14: J4.37 U5.D14(PR1A/PR2A/PR2A_||_R_GPLLT_FB**)
IO_D16: J4.35 U5.D16(PR2A/PR3A/PR3A_||_R_GPLLT_IN**)
IO_E14: J4.34 U5.E14(PR2B/PR3B/PR3B_||_R_GPLLC_IN**)
IO_E15: J4.30 U5.E15(PR1B/PR2B/PR2B_||_R_GPLLC_FB**)
IO_E16: J4.33 U5.E16(PR3A/PR5A/PR5A)
IO_F14: J4.38 U5.F14(PR4A/PR6A/PR7A)
IO_F15: J4.28 U5.F15(PR3B/PR5B/PR5B)
IO_F16: J4.29 U5.F16(PR4B/PR6B/PR7B)
IO_G14: J4.39 U5.G14(PR5B/PR8B/PR9B)
IO_G15: J4.26 U5.G15(PR5A/PR8A/PR9A)
IO_G16: J4.27 U5.G16(PR6A/PR9A/PR11A_DQS0)
IO_H14: J4.19 U5.H14(PR7A/PR10A/PR12A_||_PCLKT1_0)
IO_H15: J4.24 U5.H15(PR6B/PR9B/PR11B_DQS0N)
IO_H16: J4.25 U5.H16(PR7B/PR10B/PR12B_||_PCLKC1_0)
IO_J14: J4.18 U5.J14(PR7D/PR10D/PR15B)
IO_J15: J4.20 U5.J15(PR9A/PR13A/PR16A_DQS1)
IO_J16: J4.23 U5.J16(PR7C/PR10C/PR15A)
IO_K12: J4.3 U5.K12(PR11D/PR15D/PR19D)
IO_K13: J4.4 U5.K13(PR11C/PR15C/PR19C)
IO_K14: J4.15 U5.K14(PR10A/PR14A/PR17A)
IO_K15: J4.17 U5.K15(PR10B/PR14B/PR17B)
IO_K16: J4.16 U5.K16(PR9B/PR13B/PR16B_DQS1N)
IO_L14: J4.7 U5.L14(PR11B/PR15B/PR18B)
IO_L15: J4.13 U5.L15(PR12A/PR16A/PR21A)
IO_L16: J4.14 U5.L16(PR11A/PR15A/PR18A)
IO_M14: J4.5 U5.M14(PR13A/PR18A/PR23A)
IO_M15: J4.9 U5.M15(PR13B/PR18B/PR23B)
IO_M16: J4.10 U5.M16(PR12B/PR16B/PR21B)
IO_N14: J4.6 U5.N14(PR14B/PR19B/PR24B)
IO_N16: J4.8 U5.N16(PR14A/PR19A/PR24A)
LED0: U5.H11(PR9C/PR13C/PR16C) ; off-sheet LED0
LED1: U5.J13(PR9D/PR13D/PR16D) ; off-sheet LED1
LED2: U5.J11(PR10C/PR14C/PR17C) ; off-sheet LED2
LED3: U5.L12(PR10D/PR14D/PR17D) ; off-sheet LED3
LED4: U5.K11(PR12C/PR16C/PR21C) ; off-sheet LED4
LED5: U5.L13(PR12D/PR16D/PR21D) ; off-sheet LED5
LED6: U5.N15(PR13C/PR18C/PR23C) ; off-sheet LED6
LED7: U5.P16(PR13D/PR18D/PR23D) ; off-sheet LED7

Not connected (* = marked no-connect by the designer): J5 1(Proto_Type_Area); U5 C16(PR2C/PR4C/PR4C) D15(PR2D/PR4D/PR4D) F12(PR4C/PR6C/PR7C) F13(PR3C/PR5C/PR6C) G11(PR5C/PR8C/PR10C) G12(PR3D/PR5D/PR6D) G13(PR4D/PR6D/PR7D) H12(PR5D/PR8D/PR10D) H13(PR6C/PR9C/PR11C) J12(PR6D/PR9D/PR11D) P15(PR14C/PR20C/PR25C) R16(PR14D/PR20D/PR25D)

### Notes on the sheet
- NOTE : MAKE PWR TRACES
  CAPABLE OF 1A
- PROTOTYPE AREA
  FILL AVAILABLE AREA
- (in symbol Lattice Title Block New Brand) Lattice Semiconductor Applications; Email: techsupport@Latticesemi.com; Phone (503) 268-8001 -or- (800) LATTICE; Title; Size; Project; Schematic Rev; Board Rev; Date:; Sheet; of
- (in symbol LCMXO3L-1K/2K/4K/7K-BG256, part B) BANK1; DQ0; DQ1; ** = 2nd_Fn. applicable for 4K and 7K devices only.; 1K-2K/4K/7K || 2nd_Fn.

### Library data of the parts
C29 = 0_01uF_0402: as C57 on sheet PAGE8 - POWER DECAP AND; Digikey P/N: 399-1039-1-ND
C30-C34 = 0u1_0402: as C53 on sheet PAGE8 - POWER DECAP AND; Digikey P/N: 399-3521-2-ND
J4 = HEADER 20X2: as J6 on sheet PAGE6 - BANK2 I_0; Digikey P/N: SAM1028-20-ND
J5 = Proto Area
U5 = LCMXO3L-1K/2K/4K/7K-BG256: as U5 on sheet PAGE8 - POWER DECAP AND; Digikey P/N: 220-1886-ND; Source Package: LCMXO3L-1K/2K/4K/7K-BG256; Source Part: LCMXO3L-1K/2K/4K/7K-BG256A.Normal; Color: Default; Location X-Coordinate: 0; Manufacturer Part Number: LCMXO3L-6900C-5BG256C
*#4 = Lattice Title Block New Brand: Board Rev: A

## Sheet PAGE4 - BANK0 I_O.SchDoc
size 386 x 246 mm
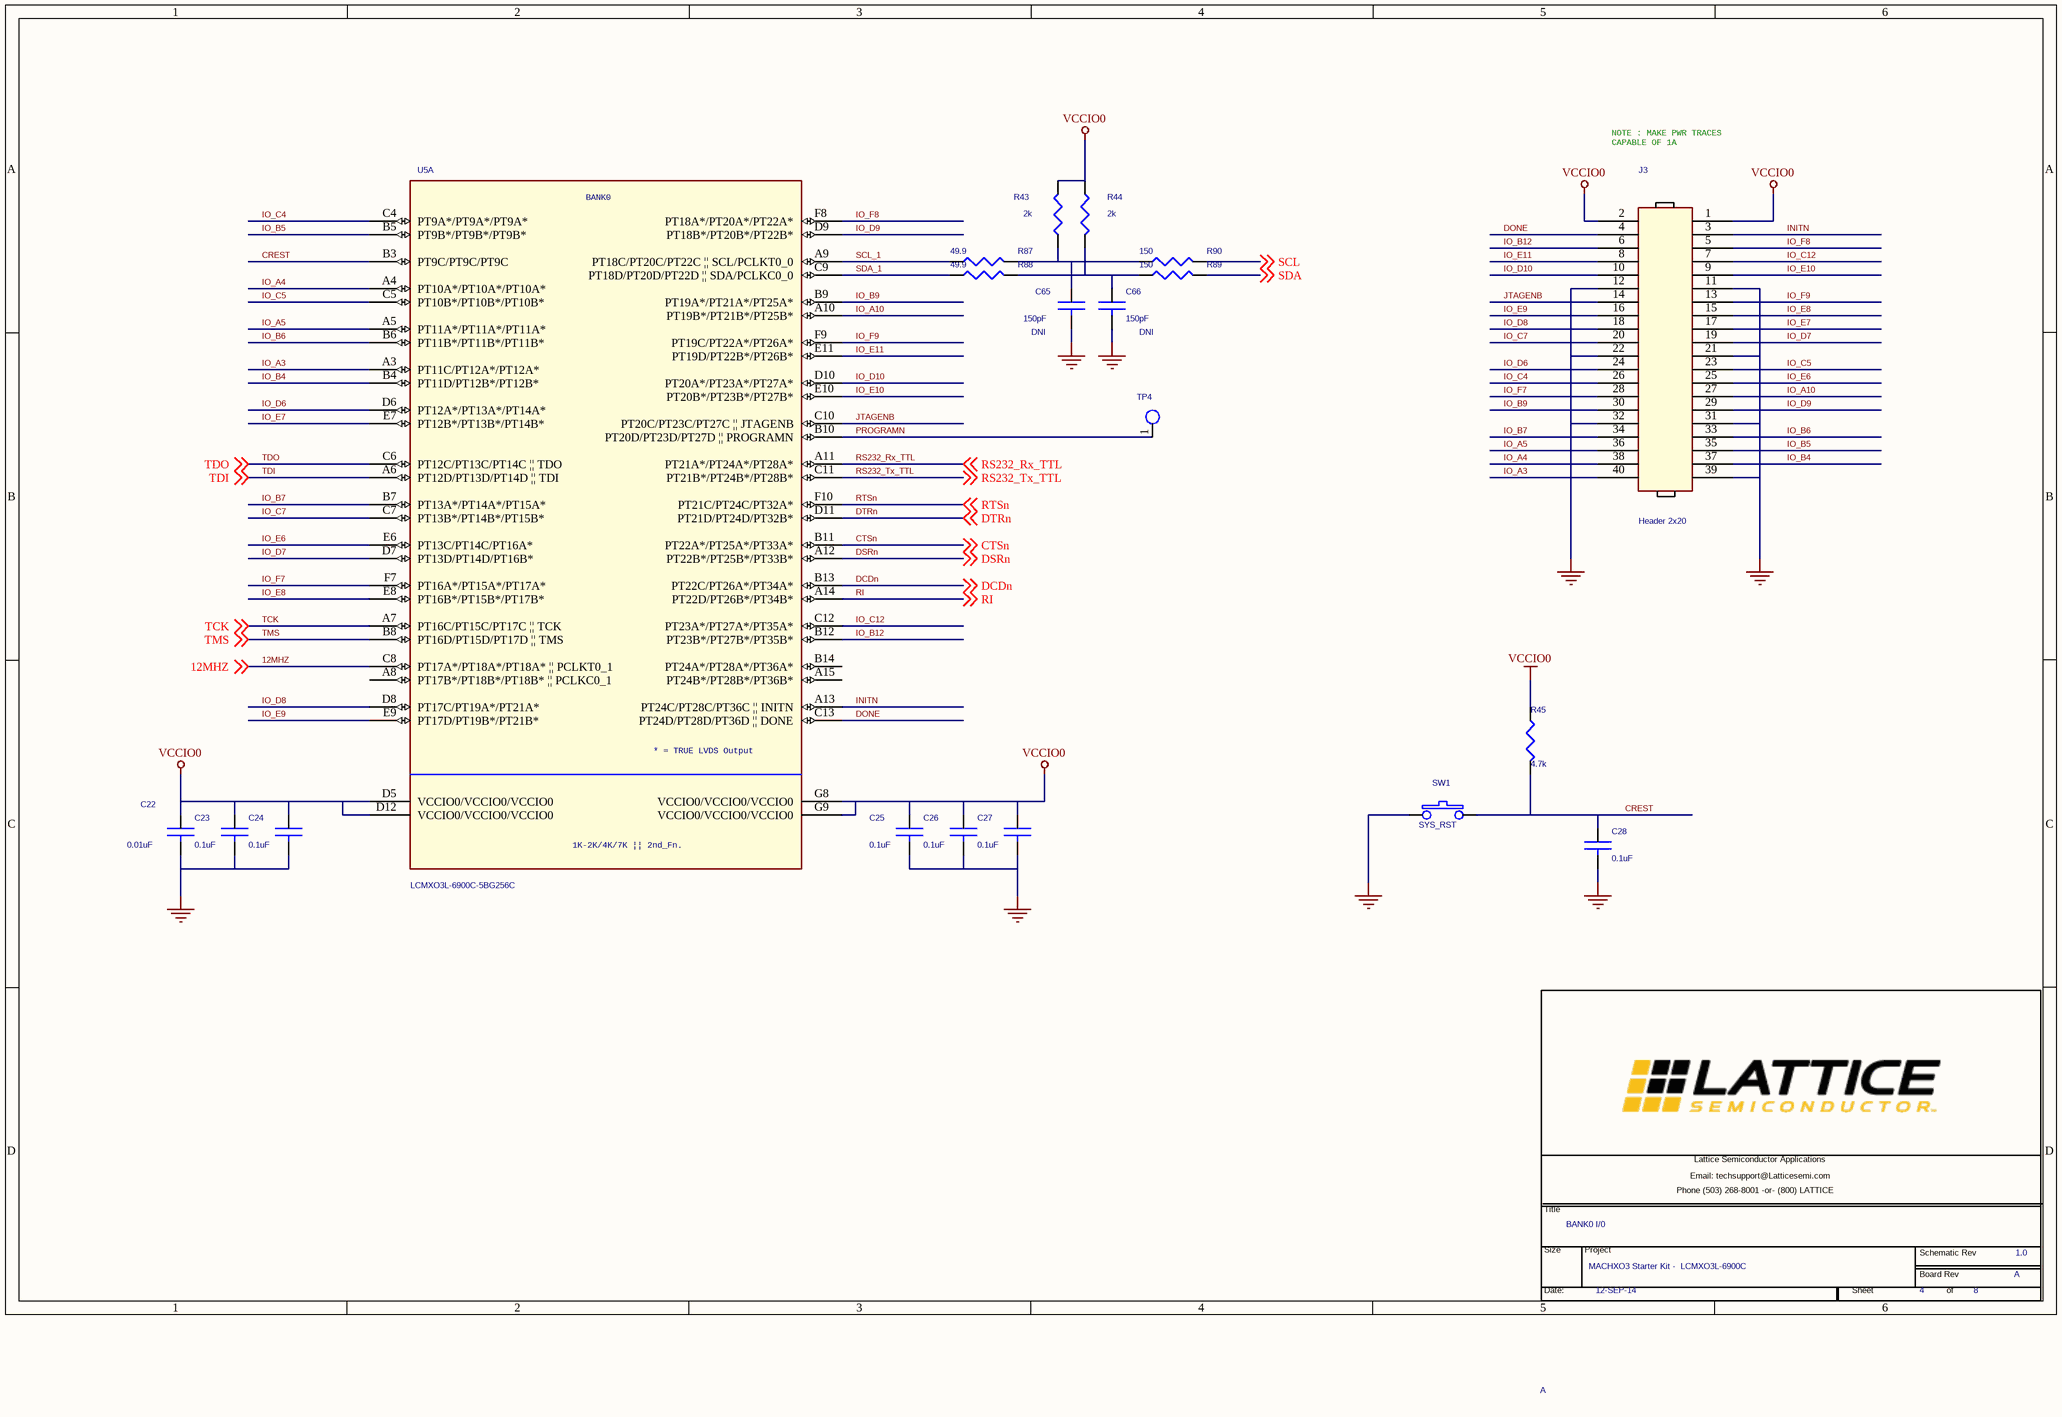
[diagram p4: PAGE4 - BANK0 I_O.SchDoc]

### Parts
(Parts that share a designator on the sheet are numbered #1, #2 ... from top to bottom, then left to right.)
*#5  Project Name: MACHXO3 Starter Kit -  LCMXO3L-6900C  Title: BANK0 I/0  Page Number: 4  Page Count: 8  RevCode: 1.0  Page Size: A  Date:: 12-SEP-14  (hidden comment: Lattice Title Block New Brand)  (graphical)
C22  0.01uF  [cc0402]
C23  0.1uF  [cc0402]
C24  0.1uF  [cc0402]
C25  0.1uF  [cc0402]
C26  0.1uF  [cc0402]
C27  0.1uF  [cc0402]
C28  0.1uF  [cc0402]
C65  150pF  Assy: DNI  [cc0402]
C66  150pF  Assy: DNI  [cc0402]
J3  Header 2x20  [hdr_samtec_mtsw_2x20_100]
R43  2k  [cr0402]
R44  2k  [cr0402]
R45  4.7k  [cr0402]
R87  49.9  [cr0603]
R88  49.9  [cr0603]
R89  150  [cr0603]
R90  150  [cr0603]
SW1  SYS_RST  [sw_sp_st_eswitch_tl1015]
TP4  tp_s_40_63  [tp_s_40_63]  (value not drawn)
U5  LCMXO3L-6900C-5BG256C  [bga256_0p8_14p0]  (part A of 7)

### Nets
GND: C22.2 C23.2 C24.2 C25.2 C26.2 C27.2 C28.2 C65.2 C66.2 J3.11 J3.12 J3.21 J3.22 J3.31 J3.32 J3.39 SW1.2
VCCIO0: C22.1 C23.1 C24.1 C25.1 C26.1 C27.1 J3.1 J3.2 R43.1 R44.1 R45.1 U5.D5(VCCIO0/VCCIO0/VCCIO0) U5.D12(VCCIO0/VCCIO0/VCCIO0) U5.G8(VCCIO0/VCCIO0/VCCIO0) U5.G9(VCCIO0/VCCIO0/VCCIO0)
12MHZ: U5.C8(PT17A*/PT18A*/PT18A*_||_PCLKT0_1) ; off-sheet 12MHZ
CREST: C28.1 R45.2 SW1.1 U5.B3(PT9C/PT9C/PT9C)
CTSn: U5.B11(PT22A*/PT25A*/PT33A*) ; off-sheet CTSn
DCDn: U5.B13(PT22C/PT26A*/PT34A*) ; off-sheet DCDn
DONE: J3.4 U5.C13(PT24D/PT28D/PT36D_||_DONE)
DSRn: U5.A12(PT22B*/PT25B*/PT33B*) ; off-sheet DSRn
DTRn: U5.D11(PT21D/PT24D/PT32B*) ; off-sheet DTRn
INITN: J3.3 U5.A13(PT24C/PT28C/PT36C_||_INITN)
IO_A3: J3.40 U5.A3(PT11C/PT12A*/PT12A*)
IO_A4: J3.38 U5.A4(PT10A*/PT10A*/PT10A*)
IO_A5: J3.36 U5.A5(PT11A*/PT11A*/PT11A*)
IO_A10: J3.27 U5.A10(PT19B*/PT21B*/PT25B*)
IO_B4: J3.37 U5.B4(PT11D/PT12B*/PT12B*)
IO_B5: J3.35 U5.B5(PT9B*/PT9B*/PT9B*)
IO_B6: J3.33 U5.B6(PT11B*/PT11B*/PT11B*)
IO_B7: J3.34 U5.B7(PT13A*/PT14A*/PT15A*)
IO_B9: J3.30 U5.B9(PT19A*/PT21A*/PT25A*)
IO_B12: J3.6 U5.B12(PT23B*/PT27B*/PT35B*)
IO_C4: J3.26 U5.C4(PT9A*/PT9A*/PT9A*)
IO_C5: J3.23 U5.C5(PT10B*/PT10B*/PT10B*)
IO_C7: J3.20 U5.C7(PT13B*/PT14B*/PT15B*)
IO_C12: J3.7 U5.C12(PT23A*/PT27A*/PT35A*)
IO_D6: J3.24 U5.D6(PT12A*/PT13A*/PT14A*)
IO_D7: J3.19 U5.D7(PT13D/PT14D/PT16B*)
IO_D8: J3.18 U5.D8(PT17C/PT19A*/PT21A*)
IO_D9: J3.29 U5.D9(PT18B*/PT20B*/PT22B*)
IO_D10: J3.10 U5.D10(PT20A*/PT23A*/PT27A*)
IO_E6: J3.25 U5.E6(PT13C/PT14C/PT16A*)
IO_E7: J3.17 U5.E7(PT12B*/PT13B*/PT14B*)
IO_E8: J3.15 U5.E8(PT16B*/PT15B*/PT17B*)
IO_E9: J3.16 U5.E9(PT17D/PT19B*/PT21B*)
IO_E10: J3.9 U5.E10(PT20B*/PT23B*/PT27B*)
IO_E11: J3.8 U5.E11(PT19D/PT22B*/PT26B*)
IO_F7: J3.28 U5.F7(PT16A*/PT15A*/PT17A*)
IO_F8: J3.5 U5.F8(PT18A*/PT20A*/PT22A*)
IO_F9: J3.13 U5.F9(PT19C/PT22A*/PT26A*)
JTAGENB: J3.14 U5.C10(PT20C/PT23C/PT27C_||_JTAGENB)
PROGRAMN: TP4.1(TP) U5.B10(PT20D/PT23D/PT27D_||_PROGRAMN)
RI: U5.A14(PT22D/PT26B*/PT34B*) ; off-sheet RI
RS232_Rx_TTL: U5.A11(PT21A*/PT24A*/PT28A*) ; off-sheet RS232_Rx_TTL
RS232_Tx_TTL: U5.C11(PT21B*/PT24B*/PT28B*) ; off-sheet RS232_Tx_TTL
RTSn: U5.F10(PT21C/PT24C/PT32A*) ; off-sheet RTSn
SCL: R90.2 ; off-sheet SCL
SCL_1: R87.1 U5.A9(PT18C/PT20C/PT22C_||_SCL/PCLKT0_0)
SDA: R89.2 ; off-sheet SDA
SDA_1: R88.1 U5.C9(PT18D/PT20D/PT22D_||_SDA/PCLKC0_0)
TCK: U5.A7(PT16C/PT15C/PT17C_||_TCK) ; off-sheet TCK
TDI: U5.A6(PT12D/PT13D/PT14D_||_TDI) ; off-sheet TDI
TDO: U5.C6(PT12C/PT13C/PT14C_||_TDO) ; off-sheet TDO
TMS: U5.B8(PT16D/PT15D/PT17D_||_TMS) ; off-sheet TMS
NetC65_1: C65.1 R43.2 R87.2 R90.1
NetC66_1: C66.1 R44.2 R88.2 R89.1

Not connected (* = marked no-connect by the designer): U5 A8(PT17B*/PT18B*/PT18B*_||_PCLKC0_1) A15(PT24B*/PT28B*/PT36B*) B14(PT24A*/PT28A*/PT36A*)

### Notes on the sheet
- NOTE : MAKE PWR TRACES
  CAPABLE OF 1A
- (in symbol Lattice Title Block New Brand) Lattice Semiconductor Applications; Email: techsupport@Latticesemi.com; Phone (503) 268-8001 -or- (800) LATTICE; Title; Size; Project; Schematic Rev; Board Rev; Date:; Sheet; of
- (in symbol LCMXO3L-1K/2K/4K/7K-BG256, part A) BANK0; * = TRUE LVDS Output; 1K-2K/4K/7K || 2nd_Fn.

### Library data of the parts
C22 = 0_01uF_0402: as C57 on sheet PAGE8 - POWER DECAP AND; Digikey P/N: 399-1039-1-ND
C23-C28 C65 C66 = 0u1_0402: as C53 on sheet PAGE8 - POWER DECAP AND; Digikey P/N: 399-3521-2-ND
J3 = HEADER 20X2: as J6 on sheet PAGE6 - BANK2 I_0; Digikey P/N: SAM1028-20-ND
R43 R44 = 5k1_0402: RES 2.0K OHM 1/10W 5% 0603 SMD; Manufacturer: Vishay; Manufacturer Part Number: CRCW06032K00JNEA; Class: Discrete; Digikey P/N: 541-2.0KGTR-ND
R45 = 5k1_0402: as R68 on sheet PAGE7 - BANK3,4,5 I_0; Digikey P/N: 541-4.70KHTR-ND
R87 R88 = 0R_0603: RES 49.9 OHM 1/10W 1% 0603 SMD; Manufacturer Part Number: CRCW060349R9FKEA; Manufacturer: Vishay; Class: Discrete; Digikey P/N: 541-49.9HTR-ND
R89 R90 = 0R_0603: RES 150 OHM 1/10W 5% 0603 SMD; Manufacturer Part Number: CRCW0603150RJNEA; Manufacturer: Vishay; Class: Discrete; Digikey P/N: 541-150GTR-ND
SW1 = SW PUSHBUTTON-SPST/SM: SWITCH TACTILE SPST-NO 0.05A 12V; Manufacturer: E-Switch; MFG P/N: TL1015AF160QG; MFG: E-Switch Inc; Man. Part #: TL1015AF160QG; Manufacturer Part Number: TL1015AF160QG; Digikey P/N: EG4344TR-ND
TP4 = TP_S_40_63: as TP12 on sheet PAGE6 - BANK2 I_0
U5 = LCMXO3L-1K/2K/4K/7K-BG256: IC FPGA 6864LUTS 256BGA; Manufacturer: Lattice semi; SPLIT_INST: TRUE; SWAP_INFO: (S1+S2+S3+S4+S5+S6+S7); Manufacturer Part Number: LCMXO3L-6900C-5BG256C; Digikey P/N: 220-1886-ND
*#5 = Lattice Title Block New Brand: Board Rev: A

## Sheet PAGE3 - POWER REGULATOR.SchDoc
size 386 x 246 mm
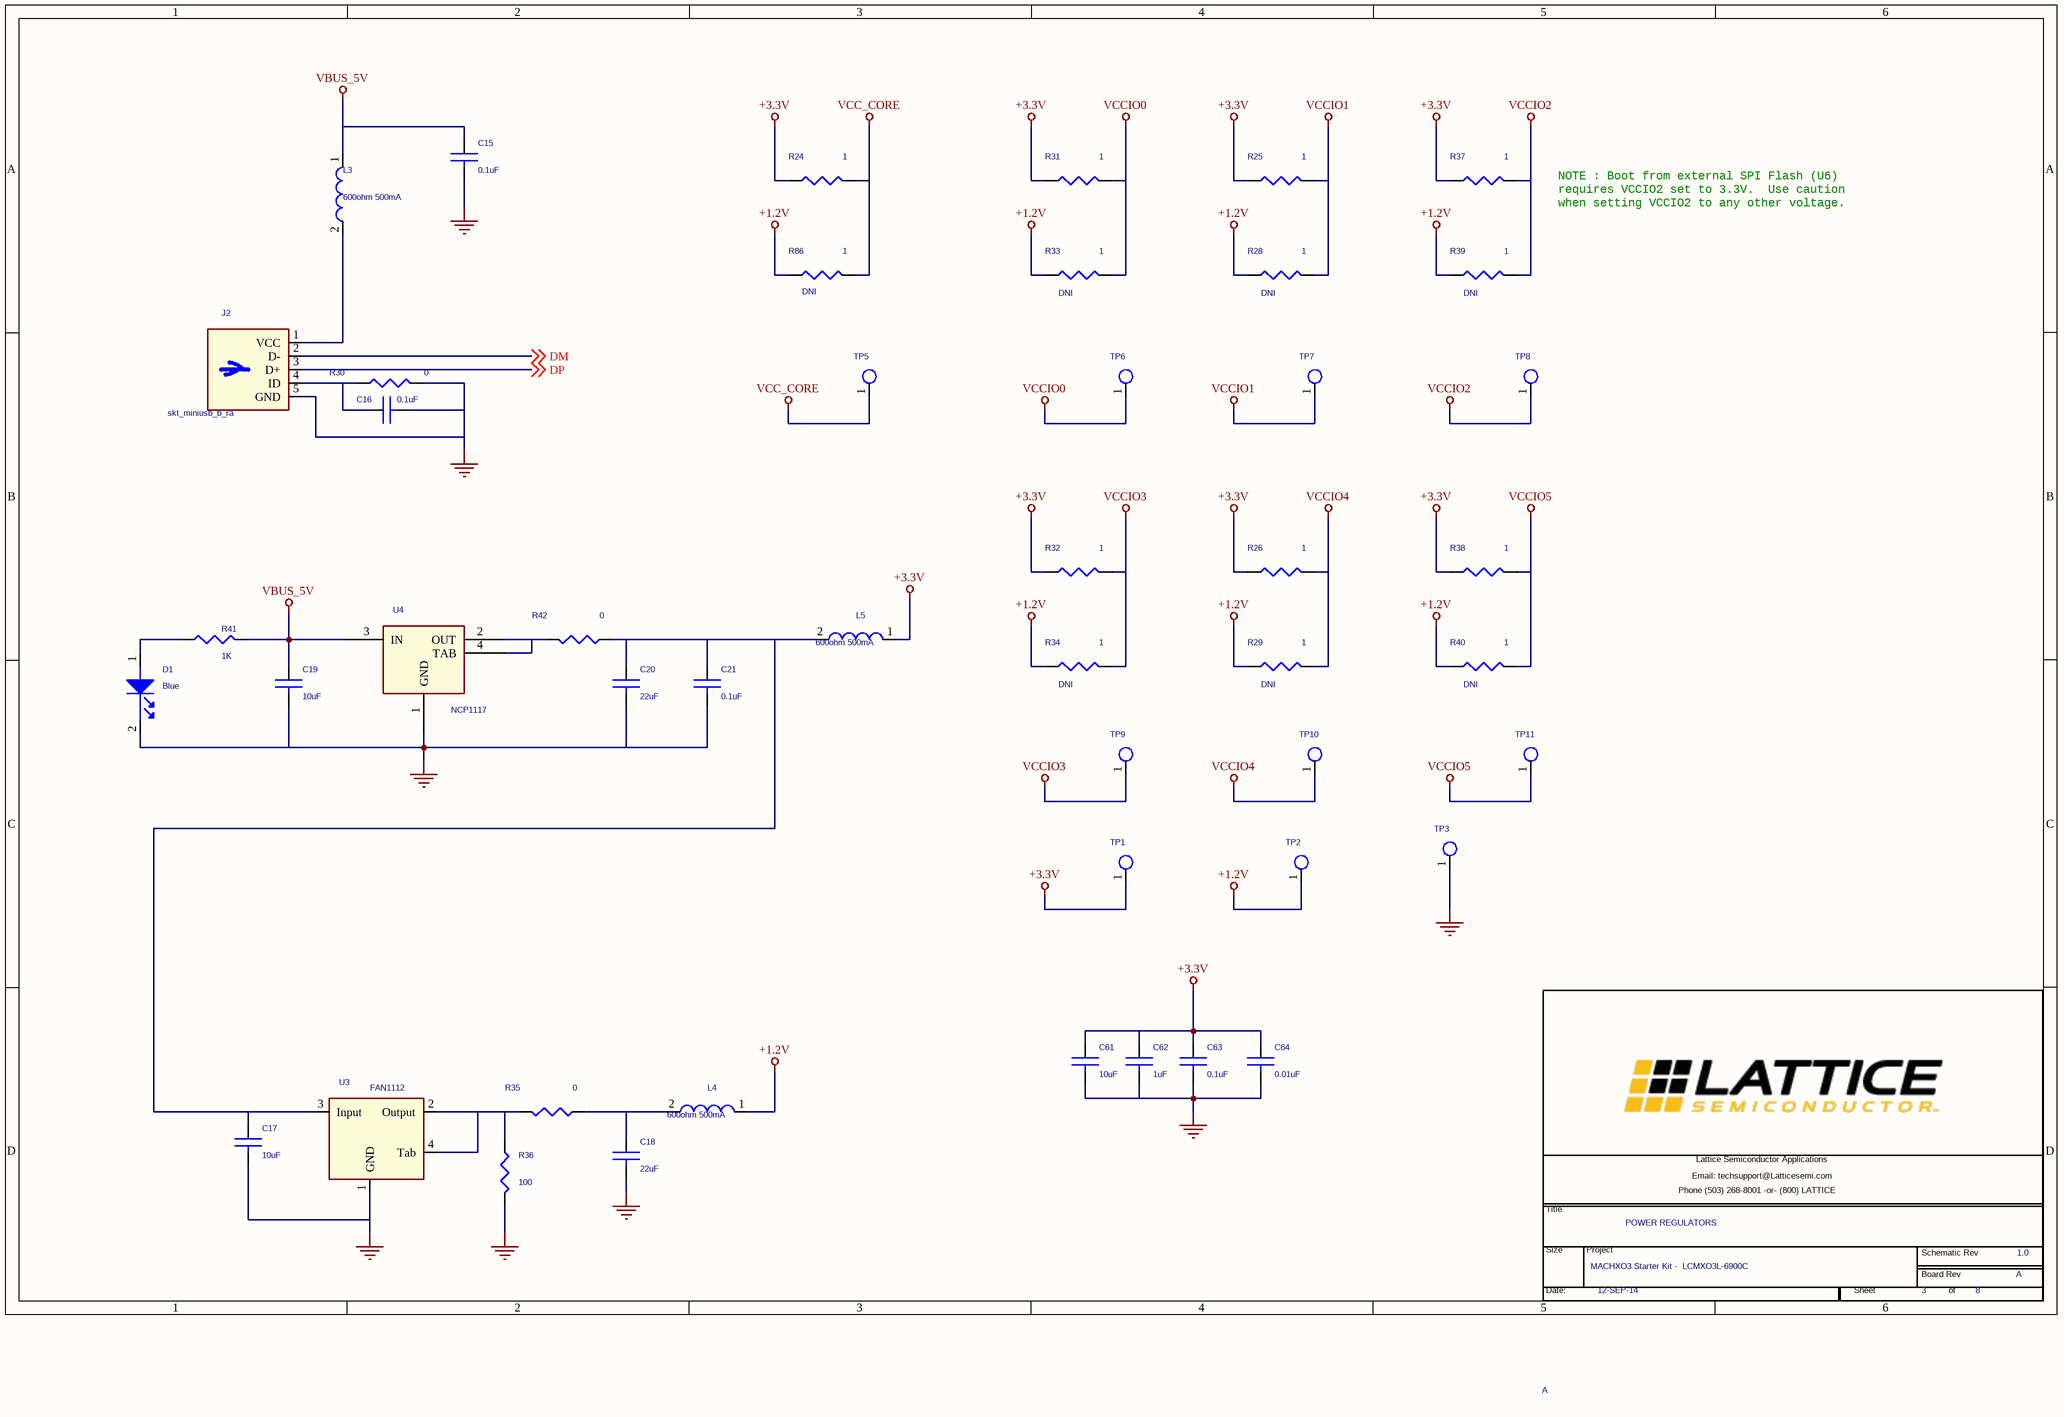
[diagram p5: PAGE3 - POWER REGULATOR.SchDoc]

### Parts
(Parts that share a designator on the sheet are numbered #1, #2 ... from top to bottom, then left to right.)
*#6  Project Name: MACHXO3 Starter Kit -  LCMXO3L-6900C  Title: POWER REGULATORS  Page Number: 3  Page Count: 8  RevCode: 1.0  Page Size: A  Date:: 12-SEP-14  (hidden comment: Lattice Title Block New Brand)  (graphical)
C15  0.1uF  [cc0402]
C16  0.1uF  [cc0402]
C17  10uF  [cc0603]
C18  22uF  [cc0805]
C19  10uF  [cc0603]
C20  22uF  [cc0805]
C21  0.1uF  [cc0402]
C61  10uF  [cc0603]
C62  1uF  [cc0402]
C63  0.1uF  [cc0402]
C64  0.01uF  [cc0402]
D1  Blue  [led_0603]
J2  skt_miniusb_b_ra  [skt_miniusb_b_ra]
L3  600ohm 500mA  [FB0603]
L4  600ohm 500mA  [FB0603]
L5  600ohm 500mA  [FB0603]
R24  1  [cr0603]
R25  1  [cr0603]
R26  1  [cr0603]
R28  1  Assy: DNI  [cr0603]
R29  1  Assy: DNI  [cr0603]
R30  0  [cr0603]
R31  1  [cr0603]
R32  1  [cr0603]
R33  1  Assy: DNI  [cr0603]
R34  1  Assy: DNI  [cr0603]
R35  0  [cr0603]
R36  100  [cr0603]
R37  1  [cr0603]
R38  1  [cr0603]
R39  1  Assy: DNI  [cr0603]
R40  1  Assy: DNI  [cr0603]
R41  1K  [cr0402]
R42  0  [cr0603]
R86  1  Assy: DNI  [cr0603]
TP1  tp_s_40_63  [tp_s_40_63]  (value not drawn)
TP2  tp_s_40_63  [tp_s_40_63]  (value not drawn)
TP3  tp_s_40_63  [tp_s_40_63]  (value not drawn)
TP5  tp_s_40_63  [tp_s_40_63]  (value not drawn)
TP6  tp_s_40_63  [tp_s_40_63]  (value not drawn)
TP7  tp_s_40_63  [tp_s_40_63]  (value not drawn)
TP8  tp_s_40_63  [tp_s_40_63]  (value not drawn)
TP9  tp_s_40_63  [tp_s_40_63]  (value not drawn)
TP10  tp_s_40_63  [tp_s_40_63]  (value not drawn)
TP11  tp_s_40_63  [tp_s_40_63]  (value not drawn)
U3  FAN1112  [sot223_4p]
U4  NCP1117  [sot223_4p]

### Nets
+1.2V: L4.1 R28.1 R29.1 R33.1 R34.1 R39.1 R40.1 R86.1 TP2.1(TP)
+3.3V: C61.1 C62.1 C63.1 C64.1 L5.1 R24.1 R25.1 R26.1 R31.1 R32.1 R37.1 R38.1 TP1.1(TP)
GND: C15.2 C16.2 C17.2 C18.2 C19.2 C20.2 C21.2 C61.2 C62.2 C63.2 C64.2 D1.2(CATHODE) J2.5(GND) R30.2 R36.2 TP3.1(TP) U3.1(GND) U4.1(GND)
VBUS_5V: C15.1 C19.1 L3.1 R41.2 U4.3(IN)
VCC_CORE: R24.2 R86.2 TP5.1(TP)
VCCIO0: R31.2 R33.2 TP6.1(TP)
VCCIO1: R25.2 R28.2 TP7.1(TP)
VCCIO2: R37.2 R39.2 TP8.1(TP)
VCCIO3: R32.2 R34.2 TP9.1(TP)
VCCIO4: R26.2 R29.2 TP10.1(TP)
VCCIO5: R38.2 R40.2 TP11.1(TP)
DM: J2.2(D-) ; off-sheet DM
DP: J2.3(D+) ; off-sheet DP
NetC16_1: C16.1 J2.4(ID) R30.1
NetC17_1: C17.1 C20.1 C21.1 L5.2 R42.1 U3.3(Input)
NetC18_1: C18.1 L4.2 R35.1
NetD1_1: D1.1(ANODE) R41.1
NetJ2_1: J2.1(VCC) L3.2
NetR35_2: R35.2 R36.1 U3.2(Output) U3.4(Tab)
NetR42_2: R42.2 U4.2(OUT) U4.4(TAB)

### Notes on the sheet
- NOTE : Boot from external SPI Flash (U6)
  requires VCCIO2 set to 3.3V.  Use caution
  when setting VCCIO2 to any other voltage.
- (in symbol Lattice Title Block New Brand) Lattice Semiconductor Applications; Email: techsupport@Latticesemi.com; Phone (503) 268-8001 -or- (800) LATTICE; Title; Size; Project; Schematic Rev; Board Rev; Date:; Sheet; of

### Library data of the parts
C15 C16 C21 C63 = 0u1_0402: as C53 on sheet PAGE8 - POWER DECAP AND; Digikey P/N: 399-3521-2-ND
C17 C19 C61 = 10uF_0603: as C51 on sheet PAGE8 - POWER DECAP AND; Digikey P/N: 587-2562-1-ND
C18 C20 = 22uF_0805: CAP CER 22UF 10V 20% X5R 0805; Manufacturer Part Number: LMK212BJ226MG-T; Manufacturer: Taiyo Yuden; Class: Discrete; Digikey P/N: 587-1958-1-ND
C62 = 1uF_0402: as C52 on sheet PAGE8 - POWER DECAP AND; Digikey P/N: 399-4873-1-ND
C64 = 0_01uF_0402: as C57 on sheet PAGE8 - POWER DECAP AND; Digikey P/N: 399-1039-1-ND
D1 = LED_0603_Green: LED 468NM BLUE CLEAR 0603 SMD; Manufacturer: LITE-On INC; Manufacturer Part Number: LTST-C190TBKT; Class: Discrete; Digikey P/N: 160-1646-1-ND
J2 = skt_miniusb_b_ra: CONN MINI USB RCPT RA TYPE B SMD; Manufacturer Part Number: 5075BMR-05-SM-CR; Manufacturer: Neltron; Class: IO
L3-L5 = FB0603: FERRITE CHIP 600 OHM 500MA 0603; Manufacturer Part Number: BLM18AG601SN1D; Manufacturer: Murata; Class: Discrete; Digikey P/N: 490-1014-1-ND
R24-R26 R28 R29 R31-R34 R37-R40 R86 = 1R_0.25W_0603: RES 1.0 OHM .25W 5% 0603 SMD; Manufacturer Part Number: CRCW06031R00JNEAHP; Manufacturer: Vishay; Class: Discrete; Digikey P/N: 541-1.0SACT-ND
R30 R35 R42 = 0R_0603: as R67 on sheet PAGE6 - BANK2 I_0; Digikey P/N: 311-0.0GRTR-ND
R36 = 100R_0603: RES 100 OHM 1/10W 1% 0603 SMD; Manufacturer: Yageo; Manufacturer Part Number: RC0603FR-07100RL; Class: Discrete; Digikey P/N: 311-100HRCT-ND
R41 = 1k_0402: as R72 on sheet PAGE8 - POWER DECAP AND; Digikey P/N: 311-1.00KHRCT-ND
TP1-TP3 TP5-TP11 = TP_S_40_63: as TP12 on sheet PAGE6 - BANK2 I_0
U3 = FAN1112: IC REG LDO 1.2V 1A SOT223-3; Manufacturer Part Number: FAN1112SX; Manufacturer: Fairchild Semi; Digikey P/N: FAN1112SXCT-ND; Class: IC
U4 = NCP1117: IC REG LDO 3.3V 1A SOT223; Manufacturer: On Semi; Manufacturer Part Number: NCP1117ST33T3G; Digikey P/N: NCP1117ST33T3GOSDKR-ND; Class: IC
*#6 = Lattice Title Block New Brand: Board Rev: A

## Sheet PAGE2 - USB to JTAG I_F.SchDoc
size 386 x 246 mm
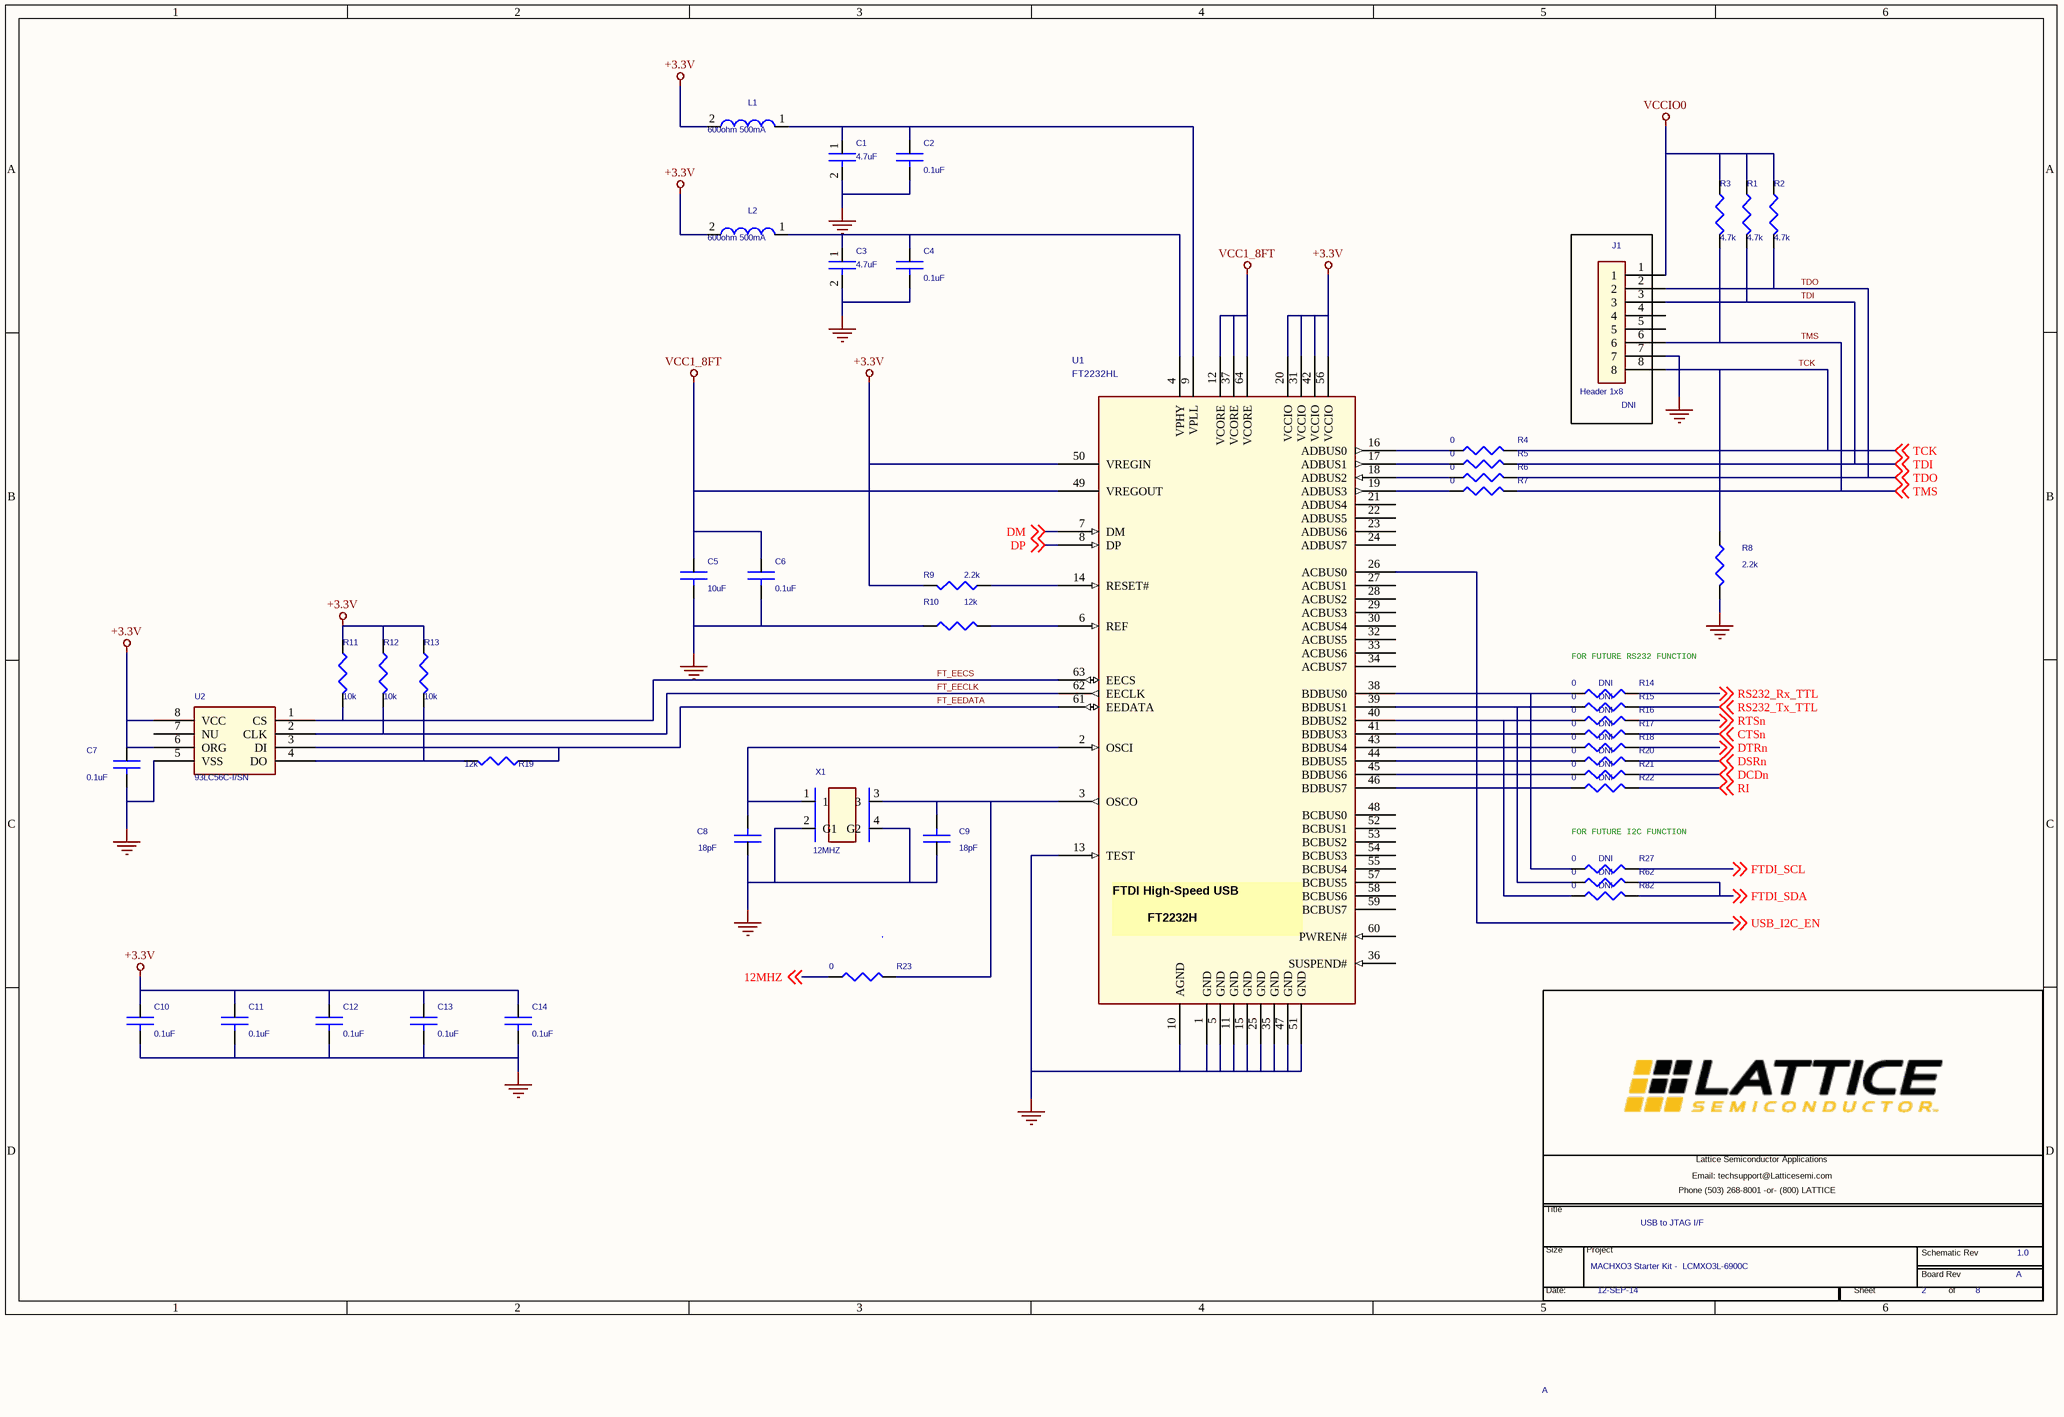
[diagram p6: PAGE2 - USB to JTAG I_F.SchDoc]

### Parts
(Parts that share a designator on the sheet are numbered #1, #2 ... from top to bottom, then left to right.)
*#7  Project Name: MACHXO3 Starter Kit -  LCMXO3L-6900C  Title: USB to JTAG I/F  Page Number: 2  Page Count: 8  RevCode: 1.0  Page Size: A  Date:: 12-SEP-14  (hidden comment: Lattice Title Block New Brand)  (graphical)
C1  4.7uF  [cc0603]
C2  0.1uF  [cc0402]
C3  4.7uF  [cc0603]
C4  0.1uF  [cc0402]
C5  10uF  [cc0603]
C6  0.1uF  [cc0402]
C7  0.1uF  [cc0402]
C8  18pF  [cc0402]
C9  18pF  [cc0402]
C10  0.1uF  [cc0402]
C11  0.1uF  [cc0402]
C12  0.1uF  [cc0402]
C13  0.1uF  [cc0402]
C14  0.1uF  [cc0402]
J1  Header 1x8  Assy: DNI  [hdr_amp_87220_8_1x8_100]
L1  600ohm 500mA  [FB0603]
L2  600ohm 500mA  [FB0603]
R1  4.7k  [cr0402]
R2  4.7k  [cr0402]
R3  4.7k  [cr0402]
R4  0  [cr0603]
R5  0  [cr0603]
R6  0  [cr0603]
R7  0  [cr0603]
R8  2.2k  [cr0402]
R9  2.2k  [cr0402]
R10  12k  [cr0402]
R11  10k  [R0402]
R12  10k  [R0402]
R13  10k  [R0402]
R14  0  Assy: DNI  [cr0603]
R15  0  Assy: DNI  [cr0603]
R16  0  Assy: DNI  [cr0603]
R17  0  Assy: DNI  [cr0603]
R18  0  Assy: DNI  [cr0603]
R19  12k  [cr0402]
R20  0  Assy: DNI  [cr0603]
R21  0  Assy: DNI  [cr0603]
R22  0  Assy: DNI  [cr0603]
R23  0  [cr0603]
R27  0  Assy: DNI  [cr0603]
R62  0  Assy: DNI  [cr0603]
R82  0  Assy: DNI  [cr0603]
U1  FT2232HL  [tqfp64_0p5_12p2x12p2_h1p6]
U2  93LC56C-I/SN  [so8_50_244]
X1  12MHZ  [crystal_4p_3p2x2p5]

### Nets
+3.3V: C7.1 C10.1 C11.1 C12.1 C13.1 C14.1 L1.2 L2.2 R9.2 R11.1 R12.1 R13.1 U1.20(VCCIO) U1.31(VCCIO) U1.42(VCCIO) U1.50(VREGIN) U1.56(VCCIO) U2.6(ORG) U2.8(VCC)
GND: C1.2 C2.2 C3.2 C4.2 C5.2 C6.2 C7.2 C8.1 C9.1 C10.2 C11.2 C12.2 C13.2 C14.2 J1.7 R8.2 R10.1 U1.1(GND) U1.5(GND) U1.10(AGND) U1.11(GND) U1.13(TEST) U1.15(GND) U1.25(GND) U1.35(GND) U1.47(GND) U1.51(GND) U2.5(VSS) X1.2(G1) X1.4(G2)
VCC1_8FT: C5.1 C6.1 U1.12(VCORE) U1.37(VCORE) U1.49(VREGOUT) U1.64(VCORE)
VCCIO0: J1.1 R1.1 R2.1 R3.1
12MHZ: R23.1 ; off-sheet 12MHZ
CTSn: R17.2 ; off-sheet CTSn
DCDn: R21.2 ; off-sheet DCDn
DM: U1.7(DM) ; off-sheet DM
DP: U1.8(DP) ; off-sheet DP
DSRn: R20.2 ; off-sheet DSRn
DTRn: R18.2 ; off-sheet DTRn
FT_EECLK: R12.2 U1.62(EECLK) U2.2(CLK)
FT_EECS: R11.2 U1.63(EECS) U2.1(CS)
FT_EEDATA: R19.1 U1.61(EEDATA) U2.3(DI)
FTDI_SCL: R27.2 ; off-sheet FTDI_SCL
FTDI_SDA: R62.2 R82.2 ; off-sheet FTDI_SDA
RI: R22.2 ; off-sheet RI
RS232_Rx_TTL: R14.2 ; off-sheet RS232_Rx_TTL
RS232_Tx_TTL: R15.2 ; off-sheet RS232_Tx_TTL
RTSn: R16.2 ; off-sheet RTSn
TCK: J1.8 R4.2 R8.1 ; off-sheet TCK
TDI: J1.3 R1.2 R5.2 ; off-sheet TDI
TDO: J1.2 R2.2 R6.2 ; off-sheet TDO
TMS: J1.6 R3.2 R7.2 ; off-sheet TMS
USB_I2C_EN: U1.26(ACBUS0) ; off-sheet USB_I2C_EN
NetC1_1: C1.1 C2.1 L1.1 U1.9(VPLL)
NetC3_1: C3.1 C4.1 L2.1 U1.4(VPHY)
NetC8_2: C8.2 U1.2(OSCI) X1.1
NetC9_2: C9.2 R23.2 U1.3(OSCO) X1.3
NetR4_1: R4.1 U1.16(ADBUS0)
NetR5_1: R5.1 U1.17(ADBUS1)
NetR6_1: R6.1 U1.18(ADBUS2)
NetR7_1: R7.1 U1.19(ADBUS3)
NetR9_1: R9.1 U1.14(RESET#)
NetR10_2: R10.2 U1.6(REF)
NetR13_2: R13.2 R19.2 U2.4(DO)
NetR14_1: R14.1 R27.1 U1.38(BDBUS0)
NetR15_1: R15.1 R62.1 U1.39(BDBUS1)
NetR16_1: R16.1 R82.1 U1.40(BDBUS2)
NetR17_1: R17.1 U1.41(BDBUS3)
NetR18_1: R18.1 U1.43(BDBUS4)
NetR20_1: R20.1 U1.44(BDBUS5)
NetR21_1: R21.1 U1.45(BDBUS6)
NetR22_1: R22.1 U1.46(BDBUS7)

Not connected (* = marked no-connect by the designer): J1 4 5; U1 21(ADBUS4) 22(ADBUS5) 23(ADBUS6) 24(ADBUS7) 27(ACBUS1) 28(ACBUS2) 29(ACBUS3) 30(ACBUS4) 32(ACBUS5) 33(ACBUS6) 34(ACBUS7) 36(SUSPEND#) 48(BCBUS0) 52(BCBUS1) 53(BCBUS2) 54(BCBUS3) 55(BCBUS4) 57(BCBUS5) 58(BCBUS6) 59(BCBUS7) 60(PWREN#); U2 7(NU)

### Notes on the sheet
- FOR FUTURE RS232 FUNCTION
- FOR FUTURE I2C FUNCTION
- (in symbol FT2232HL) FTDI High-Speed USB / FT2232H
- (in symbol Lattice Title Block New Brand) Lattice Semiconductor Applications; Email: techsupport@Latticesemi.com; Phone (503) 268-8001 -or- (800) LATTICE; Title; Size; Project; Schematic Rev; Board Rev; Date:; Sheet; of

### Library data of the parts
C1 C3 = 4u7_0603: CAP CER 4.7UF 6.3V 10% X5R 0603; Manufacturer: Panasonic; Part Number: 102033; Manufacturer Part Number: ECJ-1VB0J475K; Class: Discrete; Tolerance: 5%; Voltage: 6.3V; Digikey P/N: PCC2396CT-ND
C2 C4 C6 C7 C10-C14 = 0u1_0402: as C53 on sheet PAGE8 - POWER DECAP AND; Digikey P/N: 399-3521-2-ND
C5 = 10uF_0603: as C51 on sheet PAGE8 - POWER DECAP AND; Digikey P/N: 587-2562-1-ND
C8 C9 = 0u1_0402: CAP CER 18PF 25V 10% NP0 0402; Manufacturer Part Number: C0402C180K3GACTU; Manufacturer: Kemet; Class: Discrete; Digikey P/N: C0402C180K3GACTU-ND
J1 = header1x8_100: CONN HEADER 8POS .100 VERT TIN; Manufacturer Part Number: 0022284081; Manufacturer: Molex; Class: IO; Digikey P/N: WM50017-08-ND
L1 L2 = FB0603: as L3 on sheet PAGE3 - POWER REGULATOR; Digikey P/N: 490-1014-1-ND
R1-R3 = 5k1_0402: as R68 on sheet PAGE7 - BANK3,4,5 I_0; Digikey P/N: 541-4.70KHTR-ND
R4-R7 R14-R18 R20-R23 R27 R62 R82 = 0R_0603: as R67 on sheet PAGE6 - BANK2 I_0; Digikey P/N: 311-0.0GRTR-ND
R8 R9 = 5k1_0402: RES 2.20K OHM 1/10W 1% 0603 SMD; Manufacturer: Vishay; Manufacturer Part Number: CRCW06032K20FKEA; Class: Discrete; Digikey P/N: 541-2.20KHTR-ND
R10 R19 = 10k_0402: RES 12K OHM 1/10W 1% 0603 SMD; Manufacturer Part Number: RC0603FR-0712KL; Manufacturer: Yageo; Class: Discrete; Digikey P/N: 311-12.0KHRTR-ND; Tolerance: 1%
R11-R13 = RES_10K_1W16_0402_5P: as R64 on sheet PAGE6 - BANK2 I_0; TC1: 0; Wattage: 1/10W; Width(mm): 0.5; Length(mm): 1; Manufacturer: Stackpole Electronics Inc; Digikey P/N: RMCF0603JT10K0TR-ND
U1 = FT2232HL: IC USB HS DUAL UART/FIFO 64-LQFP; Manufacturer: FTDI; Digikey P/N: 768-1024-1-ND; Manufacturer Part Number: FT2232HL; Class: IC
U2 = 93LC56_SO8_0: IC EEPROM 2KBIT 3MHZ 8SOIC; Manufacturer: Microchip; Class: IC; Manufacturer Part Number: 93LC56C-I/SN; Digikey P/N: 93LC56C-I/SN-ND
X1 = crystal-3p2x2p5: CRYSTAL 12MHZ 18PF SMD; Manufacturer: TXC; Manufacturer Part Number: 7M-12.000MAAJ-T; Class: IC; Digikey P/N: 887-1121-2-ND
*#7 = Lattice Title Block New Brand: Board Rev: A

## Sheet PAGE1 -  Schematic cove.SchDoc
size 386 x 246 mm
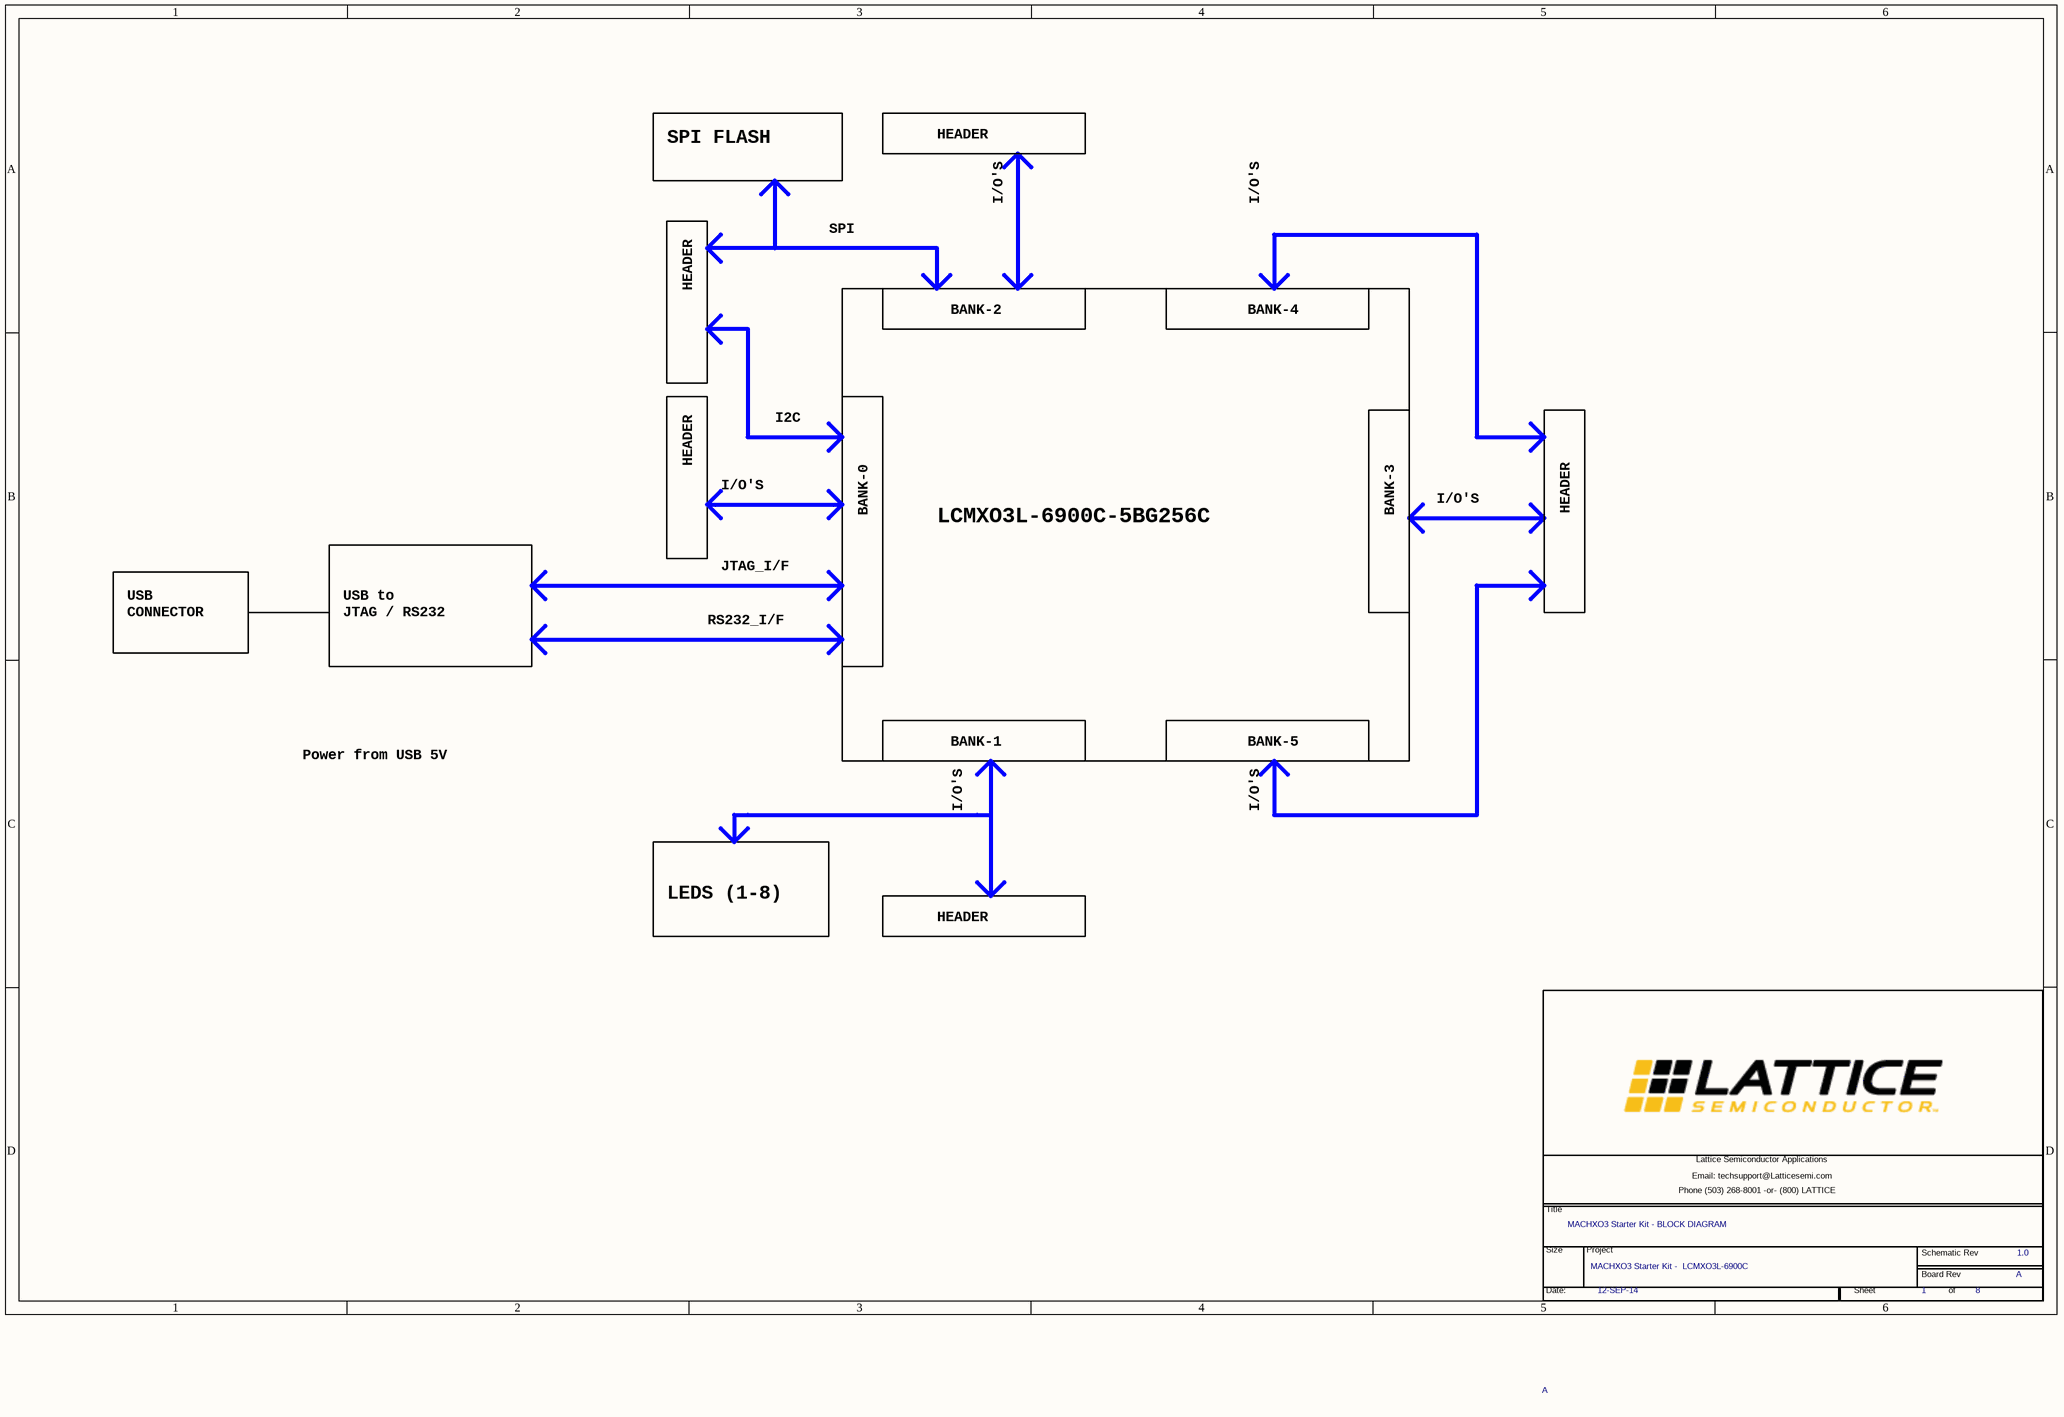
[diagram p7: PAGE1 -  Schematic cove.SchDoc]

### Parts
(Parts that share a designator on the sheet are numbered #1, #2 ... from top to bottom, then left to right.)
*#8  Project Name: MACHXO3 Starter Kit -  LCMXO3L-6900C  Title: MACHXO3 Starter Kit - BLOCK DIAGRAM  Page Number: 1  Page Count: 8  RevCode: 1.0  Page Size: A  Date:: 12-SEP-14  (hidden comment: Lattice Title Block New Brand)  (graphical)

### Notes on the sheet
- SPI FLASH
- HEADER
- SPI
- I/O'S
- BANK-2
- BANK-4
- I2C
- BANK-0
- LCMXO3L-6900C-5BG256C
- BANK-3
- USB
  CONNECTOR
- USB to
  JTAG / RS232
- JTAG_I/F
- RS232_I/F
- Power from USB 5V
- BANK-1
- BANK-5
- LEDS (1-8)
- (in symbol Lattice Title Block New Brand) Lattice Semiconductor Applications; Email: techsupport@Latticesemi.com; Phone (503) 268-8001 -or- (800) LATTICE; Title; Size; Project; Schematic Rev; Board Rev; Date:; Sheet; of

### Library data of the parts
*#8 = Lattice Title Block New Brand: Board Rev: A

## Nets that join several sheets
+3.3V: PAGE8 - POWER DECAP AND (8 pins), PAGE6 - BANK2 I_0 (6 pins), PAGE3 - POWER REGULATOR (13 pins), PAGE2 - USB to JTAG I_F (19 pins)
GND: PAGE8 - POWER DECAP AND (34 pins), PAGE7 - BANK3,4,5 I_0 (18 pins), PAGE6 - BANK2 I_0 (14 pins), PAGE5 - BANK1 I_O (12 pins), PAGE4 - BANK0 I_O (17 pins), PAGE3 - POWER REGULATOR (18 pins), PAGE2 - USB to JTAG I_F (30 pins)
VCC_CORE: PAGE8 - POWER DECAP AND (18 pins), PAGE3 - POWER REGULATOR (R24.2 R86.2 TP5.1)
VCCIO0: PAGE4 - BANK0 I_O (15 pins), PAGE3 - POWER REGULATOR (R31.2 R33.2 TP6.1), PAGE2 - USB to JTAG I_F (J1.1 R1.1 R2.1 R3.1)
VCCIO1: PAGE5 - BANK1 I_O (12 pins), PAGE3 - POWER REGULATOR (R25.2 R28.2 TP7.1)
VCCIO2: PAGE6 - BANK2 I_0 (13 pins), PAGE3 - POWER REGULATOR (R37.2 R39.2 TP8.1)
VCCIO3: PAGE7 - BANK3,4,5 I_0 (9 pins), PAGE3 - POWER REGULATOR (R32.2 R34.2 TP9.1)
VCCIO4: PAGE7 - BANK3,4,5 I_0 (6 pins), PAGE3 - POWER REGULATOR (R26.2 R29.2 TP10.1)
VCCIO5: PAGE7 - BANK3,4,5 I_0 (5 pins), PAGE3 - POWER REGULATOR (R38.2 R40.2 TP11.1)
12MHZ: PAGE4 - BANK0 I_O (U5.C8), PAGE2 - USB to JTAG I_F (R23.1)
CTSn: PAGE4 - BANK0 I_O (U5.B11), PAGE2 - USB to JTAG I_F (R17.2)
DCDn: PAGE4 - BANK0 I_O (U5.B13), PAGE2 - USB to JTAG I_F (R21.2)
DM: PAGE3 - POWER REGULATOR (J2.2), PAGE2 - USB to JTAG I_F (U1.7)
DP: PAGE3 - POWER REGULATOR (J2.3), PAGE2 - USB to JTAG I_F (U1.8)
DSRn: PAGE4 - BANK0 I_O (U5.A12), PAGE2 - USB to JTAG I_F (R20.2)
DTRn: PAGE4 - BANK0 I_O (U5.D11), PAGE2 - USB to JTAG I_F (R18.2)
FTDI_SCL: PAGE6 - BANK2 I_0 (R92.2 TP13.1), PAGE2 - USB to JTAG I_F (R27.2)
FTDI_SDA: PAGE6 - BANK2 I_0 (R91.2 TP14.1), PAGE2 - USB to JTAG I_F (R62.2 R82.2)
LED0: PAGE8 - POWER DECAP AND (D9.2), PAGE5 - BANK1 I_O (U5.H11)
LED1: PAGE8 - POWER DECAP AND (D8.2), PAGE5 - BANK1 I_O (U5.J13)
LED2: PAGE8 - POWER DECAP AND (D7.2), PAGE5 - BANK1 I_O (U5.J11)
LED3: PAGE8 - POWER DECAP AND (D6.2), PAGE5 - BANK1 I_O (U5.L12)
LED4: PAGE8 - POWER DECAP AND (D5.2), PAGE5 - BANK1 I_O (U5.K11)
LED5: PAGE8 - POWER DECAP AND (D4.2), PAGE5 - BANK1 I_O (U5.L13)
LED6: PAGE8 - POWER DECAP AND (D3.2), PAGE5 - BANK1 I_O (U5.N15)
LED7: PAGE8 - POWER DECAP AND (D2.2), PAGE5 - BANK1 I_O (U5.P16)
RI: PAGE4 - BANK0 I_O (U5.A14), PAGE2 - USB to JTAG I_F (R22.2)
RS232_Rx_TTL: PAGE4 - BANK0 I_O (U5.A11), PAGE2 - USB to JTAG I_F (R14.2)
RS232_Tx_TTL: PAGE4 - BANK0 I_O (U5.C11), PAGE2 - USB to JTAG I_F (R15.2)
RTSn: PAGE4 - BANK0 I_O (U5.F10), PAGE2 - USB to JTAG I_F (R16.2)
SCL: PAGE6 - BANK2 I_0 (J7.2 R92.1), PAGE4 - BANK0 I_O (R90.2)
SDA: PAGE6 - BANK2 I_0 (J7.1 R91.1), PAGE4 - BANK0 I_O (R89.2)
TCK: PAGE4 - BANK0 I_O (U5.A7), PAGE2 - USB to JTAG I_F (J1.8 R4.2 R8.1)
TDI: PAGE4 - BANK0 I_O (U5.A6), PAGE2 - USB to JTAG I_F (J1.3 R1.2 R5.2)
TDO: PAGE4 - BANK0 I_O (U5.C6), PAGE2 - USB to JTAG I_F (J1.2 R2.2 R6.2)
TMS: PAGE4 - BANK0 I_O (U5.B8), PAGE2 - USB to JTAG I_F (J1.6 R3.2 R7.2)
USB_I2C_EN: PAGE6 - BANK2 I_0 (TP15.1), PAGE2 - USB to JTAG I_F (U1.26)